# Altium project flying_pcb_v1.2.PrjPcb (part 1 of 2)
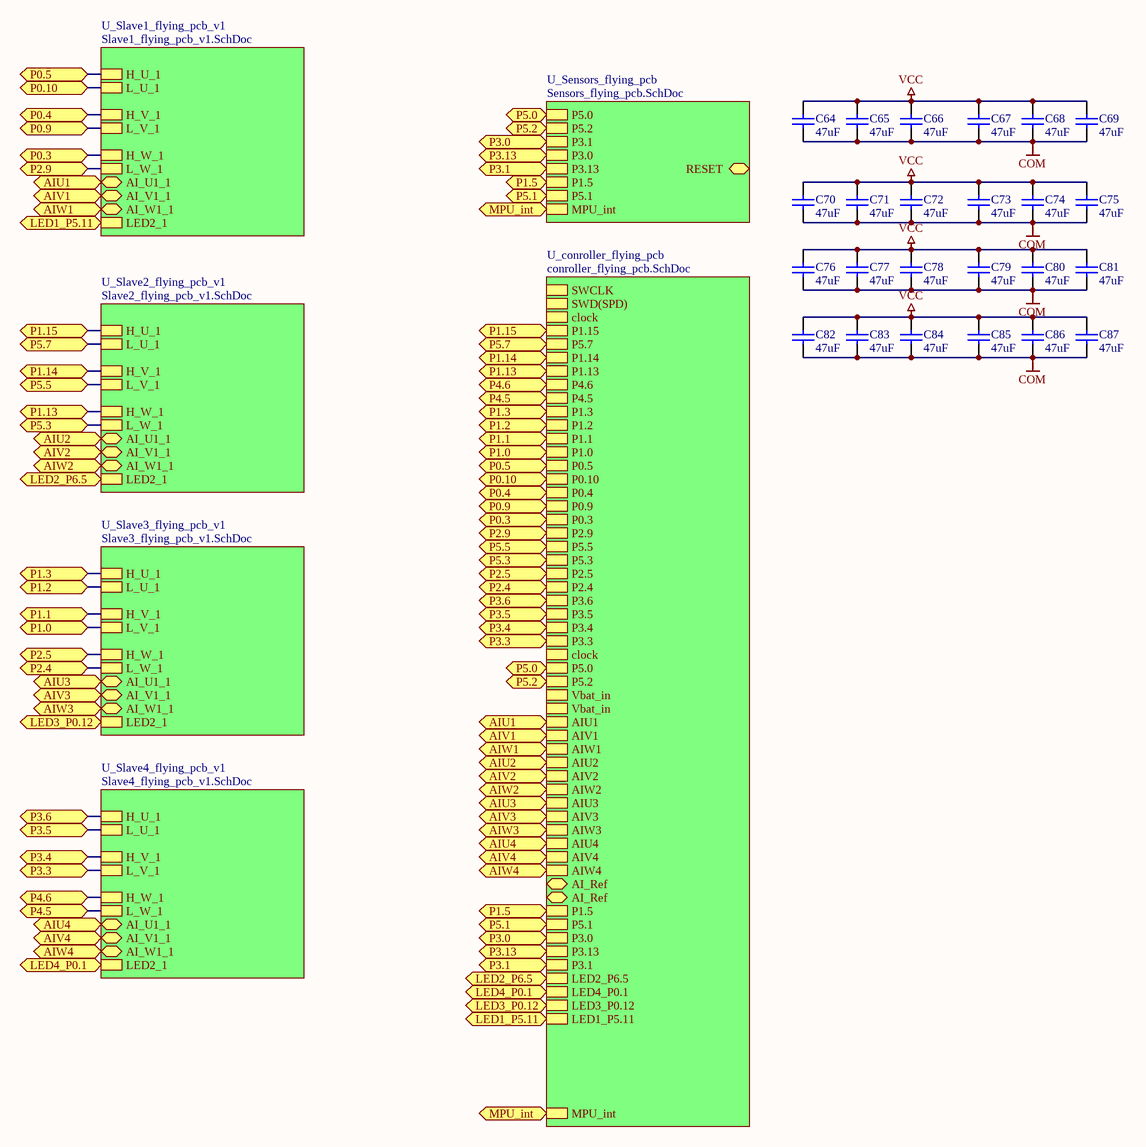
[diagram p0: Master_flying_pcb_v1.SchDoc]
7 sheets, 231 parts. Net scope: hierarchical (ports join the sheet entries above them; power ports are global).
Board file: flying_pcb_v1_production.PcbDoc
Sheets:
  Master_flying_pcb_v1.SchDoc
    U_Slave1_flying_pcb_v1 = Slave1_flying_pcb_v1.SchDoc
    U_Slave2_flying_pcb_v1 = Slave2_flying_pcb_v1.SchDoc
    U_Slave3_flying_pcb_v1 = Slave3_flying_pcb_v1.SchDoc
    U_Slave4_flying_pcb_v1 = Slave4_flying_pcb_v1.SchDoc
    U_Sensors_flying_pcb = Sensors_flying_pcb.SchDoc
    U_conroller_flying_pcb = conroller_flying_pcb.SchDoc

## Sheet Master_flying_pcb_v1.SchDoc
size A3

### Parts
C64  47uF  [_0805]
C65  47uF  [_0805]
C66  47uF  [_0805]
C67  47uF  [_0805]
C68  47uF  [_0805]
C69  47uF  [_0805]
C70  47uF  [_0805]
C71  47uF  [_0805]
C72  47uF  [_0805]
C73  47uF  [_0805]
C74  47uF  [_0805]
C75  47uF  [_0805]
C76  47uF  [_0805]
C77  47uF  [_0805]
C78  47uF  [_0805]
C79  47uF  [_0805]
C80  47uF  [_0805]
C81  47uF  [_0805]
C82  47uF  [_0805]
C83  47uF  [_0805]
C84  47uF  [_0805]
C85  47uF  [_0805]
C86  47uF  [_0805]
C87  47uF  [_0805]

### Sub-sheets
U_conroller_flying_pcb = conroller_flying_pcb.SchDoc: SWCLK, SWD(SPD), clock, P1.15, P5.7, P1.14, P1.13, P4.6, P4.5, P1.3, P1.2, P1.1, P1.0, P0.5, P0.10, P0.4, P0.9, P0.3, P2.9, P5.5, P5.3, P2.5, P2.4, P3.6, P3.5, P3.4, P3.3, clock, P5.0, P5.2, Vbat_in, Vbat_in, AIU1, AIV1, AIW1, AIU2, AIV2, AIW2, AIU3, AIV3, AIW3, AIU4, AIV4, AIW4, AI_Ref (bidir), AI_Ref (bidir), P1.5, P5.1, P3.0, P3.13, P3.1, LED2_P6.5, LED4_P0.1, LED3_P0.12, LED1_P5.11, MPU_int
U_Sensors_flying_pcb = Sensors_flying_pcb.SchDoc: P5.0, P5.2, P3.1, P3.0, P3.13, P1.5, P5.1, MPU_int, RESET
U_Slave1_flying_pcb_v1 = Slave1_flying_pcb_v1.SchDoc: H_U_1, L_U_1, H_V_1, L_V_1, H_W_1, L_W_1, AI_U1_1 (bidir), AI_V1_1 (bidir), AI_W1_1 (bidir), LED2_1
U_Slave2_flying_pcb_v1 = Slave2_flying_pcb_v1.SchDoc: H_U_1, L_U_1, H_V_1, L_V_1, H_W_1, L_W_1, AI_U1_1 (bidir), AI_V1_1 (bidir), AI_W1_1 (bidir), LED2_1
U_Slave3_flying_pcb_v1 = Slave3_flying_pcb_v1.SchDoc: H_U_1, L_U_1, H_V_1, L_V_1, H_W_1, L_W_1, AI_U1_1 (bidir), AI_V1_1 (bidir), AI_W1_1 (bidir), LED2_1
U_Slave4_flying_pcb_v1 = Slave4_flying_pcb_v1.SchDoc: H_U_1, L_U_1, H_V_1, L_V_1, H_W_1, L_W_1, AI_U1_1 (bidir), AI_V1_1 (bidir), AI_W1_1 (bidir), LED2_1

### Ports
AIU1, AIU2, AIU3, AIU4, AIV1, AIV2, AIV3, AIV4, AIW1, AIW2, AIW3, AIW4, LED1_P5.11, LED2_P6.5, LED3_P0.12, LED4_P0.1, MPU_int, P0.3, P0.4, P0.5, P0.9, P0.10, P1.0, P1.1, P1.2, P1.3, P1.5, P1.13, P1.14, P1.15, P2.4, P2.5, P2.9, P3.0, P3.1, P3.3, P3.4, P3.5, P3.6, P3.13, P4.5, P4.6, P5.0, P5.1, P5.2, P5.3, P5.5, P5.7

### Nets
COM: C64.1 C65.1 C66.1 C67.1 C68.1 C69.1 C70.1 C71.1 C72.1 C73.1 C74.1 C75.1 C76.1 C77.1 C78.1 C79.1 C80.1 C81.1 C82.1 C83.1 C84.1 C85.1 C86.1 C87.1
VCC: C64.2 C65.2 C66.2 C67.2 C68.2 C69.2 C70.2 C71.2 C72.2 C73.2 C74.2 C75.2 C76.2 C77.2 C78.2 C79.2 C80.2 C81.2 C82.2 C83.2 C84.2 C85.2 C86.2 C87.2
NetC38_2: sheet U_conroller_flying_pcb/Vbat_in, sheet U_conroller_flying_pcb/Vbat_in
NetDPS310_P3: port P3.1, sheet U_Sensors_flying_pcb/P3.13, sheet U_conroller_flying_pcb/P3.1
NetDPS310_P4: port P3.13, sheet U_Sensors_flying_pcb/P3.0, sheet U_conroller_flying_pcb/P3.13
NetDPS310_P5: port P3.0, sheet U_Sensors_flying_pcb/P3.1, sheet U_conroller_flying_pcb/P3.0
NetPAN1026_E6: port P5.1, sheet U_Sensors_flying_pcb/P5.1, sheet U_conroller_flying_pcb/P5.1
NetPAN1026_F7: port P1.5, sheet U_Sensors_flying_pcb/P1.5, sheet U_conroller_flying_pcb/P1.5
NetQ13_3: sheet U_conroller_flying_pcb/clock, sheet U_conroller_flying_pcb/clock
NetQ14_12: port MPU_int, sheet U_Sensors_flying_pcb/MPU_int, sheet U_conroller_flying_pcb/MPU_int
NetQ14_23: port P5.2, sheet U_Sensors_flying_pcb/P5.2, sheet U_conroller_flying_pcb/P5.2
NetQ14_24: port P5.0, sheet U_Sensors_flying_pcb/P5.0, sheet U_conroller_flying_pcb/P5.0
NetR3_2: port AIU1, sheet U_Slave1_flying_pcb_v1/AI_U1_1, sheet U_conroller_flying_pcb/AIU1
NetR9_2: port AIV1, sheet U_Slave1_flying_pcb_v1/AI_V1_1, sheet U_conroller_flying_pcb/AIV1
NetR15_2: port AIW1, sheet U_Slave1_flying_pcb_v1/AI_W1_1, sheet U_conroller_flying_pcb/AIW1
NetR19_1: port LED1_P5.11, sheet U_Slave1_flying_pcb_v1/LED2_1, sheet U_conroller_flying_pcb/LED1_P5.11
NetR22_2: port AIU2, sheet U_Slave2_flying_pcb_v1/AI_U1_1, sheet U_conroller_flying_pcb/AIU2
NetR28_2: port AIV2, sheet U_Slave2_flying_pcb_v1/AI_V1_1, sheet U_conroller_flying_pcb/AIV2
NetR34_2: port AIW2, sheet U_Slave2_flying_pcb_v1/AI_W1_1, sheet U_conroller_flying_pcb/AIW2
NetR38_1: port LED2_P6.5, sheet U_Slave2_flying_pcb_v1/LED2_1, sheet U_conroller_flying_pcb/LED2_P6.5
NetR41_2: port AIU3, sheet U_Slave3_flying_pcb_v1/AI_U1_1, sheet U_conroller_flying_pcb/AIU3
NetR47_2: port AIV3, sheet U_Slave3_flying_pcb_v1/AI_V1_1, sheet U_conroller_flying_pcb/AIV3
NetR53_2: port AIW3, sheet U_Slave3_flying_pcb_v1/AI_W1_1, sheet U_conroller_flying_pcb/AIW3
NetR57_1: port LED3_P0.12, sheet U_Slave3_flying_pcb_v1/LED2_1, sheet U_conroller_flying_pcb/LED3_P0.12
NetR60_2: port AIU4, sheet U_Slave4_flying_pcb_v1/AI_U1_1, sheet U_conroller_flying_pcb/AIU4
NetR66_2: port AIV4, sheet U_Slave4_flying_pcb_v1/AI_V1_1, sheet U_conroller_flying_pcb/AIV4
NetR72_2: port AIW4, sheet U_Slave4_flying_pcb_v1/AI_W1_1, sheet U_conroller_flying_pcb/AIW4
NetR76_1: port LED4_P0.1, sheet U_Slave4_flying_pcb_v1/LED2_1, sheet U_conroller_flying_pcb/LED4_P0.1
NetR86_2: sheet U_conroller_flying_pcb/AI_Ref, sheet U_conroller_flying_pcb/AI_Ref
NetU1_2: port P0.5, sheet U_Slave1_flying_pcb_v1/H_U_1, sheet U_conroller_flying_pcb/P0.5
NetU1_3: port P0.10, sheet U_Slave1_flying_pcb_v1/L_U_1, sheet U_conroller_flying_pcb/P0.10
NetU2_2: port P0.4, sheet U_Slave1_flying_pcb_v1/H_V_1, sheet U_conroller_flying_pcb/P0.4
NetU2_3: port P0.9, sheet U_Slave1_flying_pcb_v1/L_V_1, sheet U_conroller_flying_pcb/P0.9
NetU3_2: port P0.3, sheet U_Slave1_flying_pcb_v1/H_W_1, sheet U_conroller_flying_pcb/P0.3
NetU3_3: port P2.9, sheet U_Slave1_flying_pcb_v1/L_W_1, sheet U_conroller_flying_pcb/P2.9
NetU4_2: port P1.15, sheet U_Slave2_flying_pcb_v1/H_U_1, sheet U_conroller_flying_pcb/P1.15
NetU4_3: port P5.7, sheet U_Slave2_flying_pcb_v1/L_U_1, sheet U_conroller_flying_pcb/P5.7
NetU5_2: port P1.14, sheet U_Slave2_flying_pcb_v1/H_V_1, sheet U_conroller_flying_pcb/P1.14
NetU5_3: port P5.5, sheet U_Slave2_flying_pcb_v1/L_V_1, sheet U_conroller_flying_pcb/P5.5
NetU6_2: port P1.13, sheet U_Slave2_flying_pcb_v1/H_W_1, sheet U_conroller_flying_pcb/P1.13
NetU6_3: port P5.3, sheet U_Slave2_flying_pcb_v1/L_W_1, sheet U_conroller_flying_pcb/P5.3
NetU7_2: port P1.3, sheet U_Slave3_flying_pcb_v1/H_U_1, sheet U_conroller_flying_pcb/P1.3
NetU7_3: port P1.2, sheet U_Slave3_flying_pcb_v1/L_U_1, sheet U_conroller_flying_pcb/P1.2
NetU8_2: port P1.1, sheet U_Slave3_flying_pcb_v1/H_V_1, sheet U_conroller_flying_pcb/P1.1
NetU8_3: port P1.0, sheet U_Slave3_flying_pcb_v1/L_V_1, sheet U_conroller_flying_pcb/P1.0
NetU9_2: port P2.5, sheet U_Slave3_flying_pcb_v1/H_W_1, sheet U_conroller_flying_pcb/P2.5
NetU9_3: port P2.4, sheet U_Slave3_flying_pcb_v1/L_W_1, sheet U_conroller_flying_pcb/P2.4
NetU10_2: port P3.6, sheet U_Slave4_flying_pcb_v1/H_U_1, sheet U_conroller_flying_pcb/P3.6
NetU10_3: port P3.5, sheet U_Slave4_flying_pcb_v1/L_U_1, sheet U_conroller_flying_pcb/P3.5
NetU11_2: port P3.4, sheet U_Slave4_flying_pcb_v1/H_V_1, sheet U_conroller_flying_pcb/P3.4
NetU11_3: port P3.3, sheet U_Slave4_flying_pcb_v1/L_V_1, sheet U_conroller_flying_pcb/P3.3
NetU12_2: port P4.6, sheet U_Slave4_flying_pcb_v1/H_W_1, sheet U_conroller_flying_pcb/P4.6
NetU12_3: port P4.5, sheet U_Slave4_flying_pcb_v1/L_W_1, sheet U_conroller_flying_pcb/P4.5

### Library data of the parts
C64-C87 = Cap_128: Name: Cap_0805; QR: 0; UID: Cap_128; ComponentLink1URL: #NAME?; mounting: SMD

## Sheet Slave1_flying_pcb_v1.SchDoc
size A4
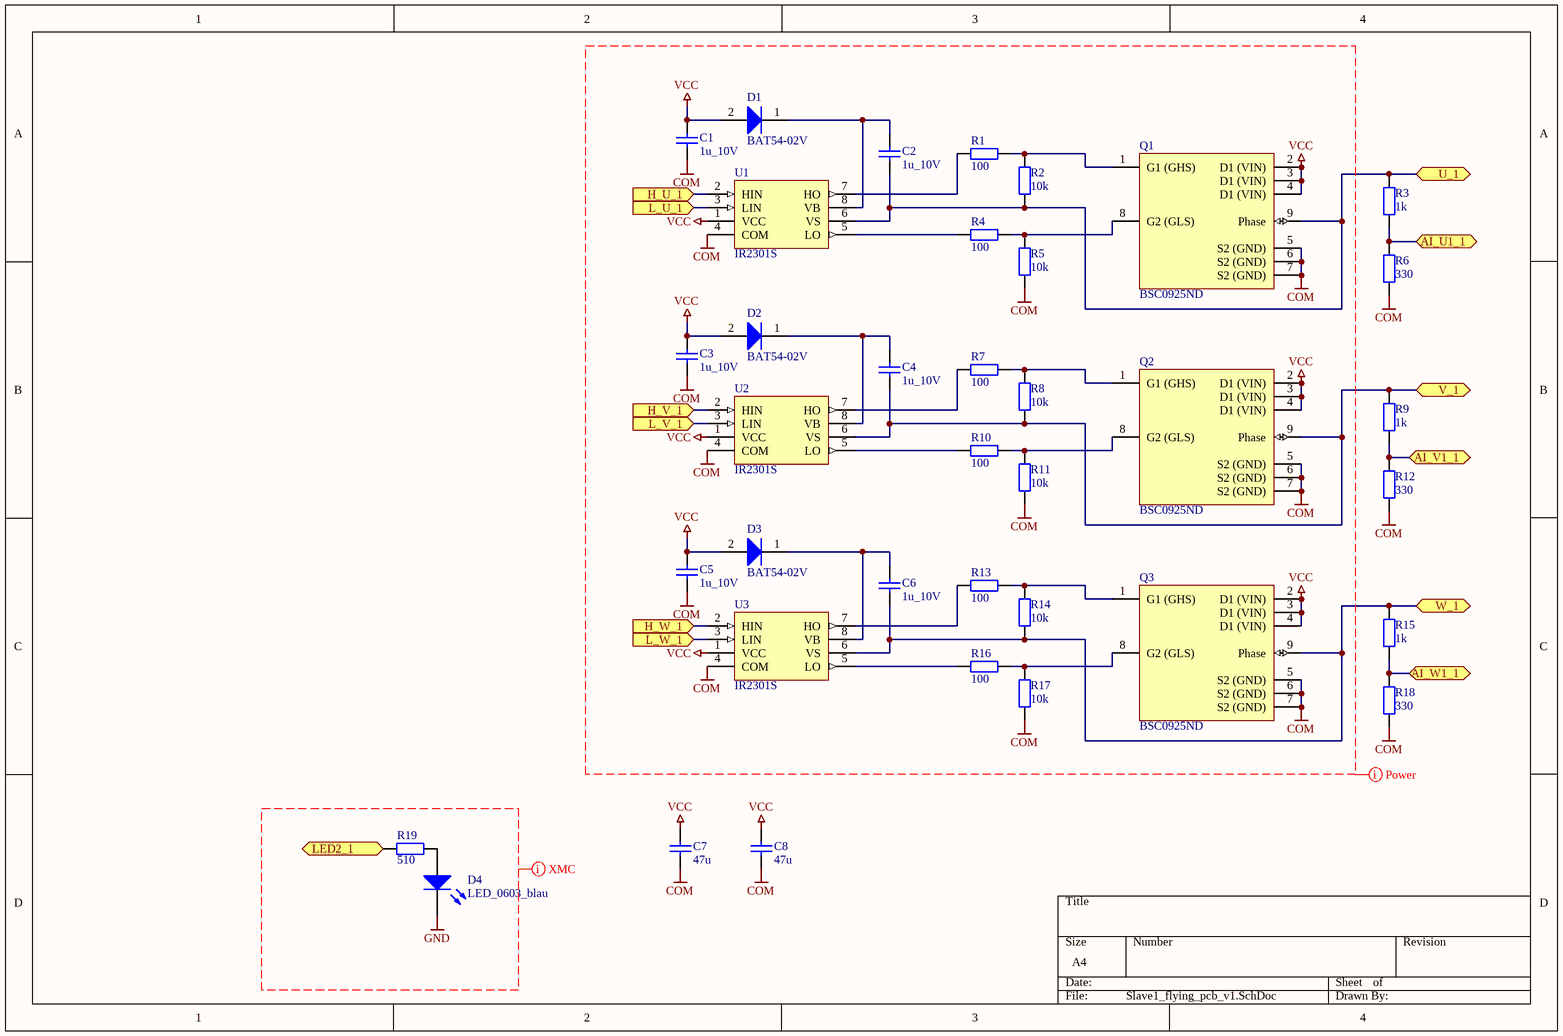
[diagram p1: Slave1_flying_pcb_v1.SchDoc]

### Parts
C1  1u_10V  [1608[0603]]
C2  1u_10V  [1608[0603]]
C3  1u_10V  [1608[0603]]
C4  1u_10V  [1608[0603]]
C5  1u_10V  [1608[0603]]
C6  1u_10V  [1608[0603]]
C7  47u  [_0805]
C8  47u  [_0805]
D1  BAT54-02V  [INF-SC79_V]
D2  BAT54-02V  [INF-SC79_V]
D3  BAT54-02V  [INF-SC79_V]
D4  LED_0603_blau  [LED_0603]
Q1  BSC0925ND  [INF-PG-TISON-8_V]
Q2  BSC0925ND  [INF-PG-TISON-8_V]
Q3  BSC0925ND  [INF-PG-TISON-8_V]
R1  value 100  [1608[0603]]  (hidden comment: Res_0603)
R2  value 10k  [1608[0603]]  (hidden comment: Res_0603)
R3  value 1k  [1608[0603]]  (hidden comment: Res_0603)
R4  value 100  [1608[0603]]  (hidden comment: Res_0603)
R5  value 10k  [1608[0603]]  (hidden comment: Res_0603)
R6  value 330  [1608[0603]]  (hidden comment: Res_0603)
R7  value 100  [1608[0603]]  (hidden comment: Res_0603)
R8  value 10k  [1608[0603]]  (hidden comment: Res_0603)
R9  value 1k  [1608[0603]]  (hidden comment: Res_0603)
R10  value 100  [1608[0603]]  (hidden comment: Res_0603)
R11  value 10k  [1608[0603]]  (hidden comment: Res_0603)
R12  value 330  [1608[0603]]  (hidden comment: Res_0603)
R13  value 100  [1608[0603]]  (hidden comment: Res_0603)
R14  value 10k  [1608[0603]]  (hidden comment: Res_0603)
R15  value 1k  [1608[0603]]  (hidden comment: Res_0603)
R16  value 100  [1608[0603]]  (hidden comment: Res_0603)
R17  value 10k  [1608[0603]]  (hidden comment: Res_0603)
R18  value 330  [1608[0603]]  (hidden comment: Res_0603)
R19  value 510  [1608[0603]]  (hidden comment: Res_0603)
U1  IR2301S  [SO-8_N]
U2  IR2301S  [SO-8_N]
U3  IR2301S  [SO-8_N]

### Ports
AI_U1_1 (bidir), AI_V1_1 (bidir), AI_W1_1 (bidir), H_U_1, H_V_1, H_W_1, L_U_1, L_V_1, L_W_1, LED2_1, U_1 (bidir), V_1 (bidir), W_1 (bidir)

### Nets
COM: C1.2 C3.2 C5.2 C7.1 C8.1 Q1.5(S2_(GND)) Q1.6(S2_(GND)) Q1.7(S2_(GND)) Q2.5(S2_(GND)) Q2.6(S2_(GND)) Q2.7(S2_(GND)) Q3.5(S2_(GND)) Q3.6(S2_(GND)) Q3.7(S2_(GND)) R5.2 R6.2 R11.2 R12.2 R17.2 R18.2 U1.4(COM) U2.4(COM) U3.4(COM)
GND: D4.2
VCC: C1.1 C3.1 C5.1 C7.2 C8.2 D1.2(A) D2.2(A) D3.2(A) Q1.2(D1_(VIN)) Q1.3(D1_(VIN)) Q1.4(D1_(VIN)) Q2.2(D1_(VIN)) Q2.3(D1_(VIN)) Q2.4(D1_(VIN)) Q3.2(D1_(VIN)) Q3.3(D1_(VIN)) Q3.4(D1_(VIN)) U1.1(VCC) U2.1(VCC) U3.1(VCC)
NetC2_1: C2.1 D1.1(K) U1.8(VB)
NetC2_2: C2.2 Q1.9(Phase) R2.2 R3.1 U1.6(VS) ; port U_1
NetC4_1: C4.1 D2.1(K) U2.8(VB)
NetC4_2: C4.2 Q2.9(Phase) R8.2 R9.1 U2.6(VS) ; port V_1
NetC6_1: C6.1 D3.1(K) U3.8(VB)
NetC6_2: C6.2 Q3.9(Phase) R14.2 R15.1 U3.6(VS) ; port W_1
NetD4_1: D4.1 R19.2
NetQ1_1: Q1.1(G1_(GHS)) R1.1 R2.1
NetQ1_8: Q1.8(G2_(GLS)) R4.1 R5.1
NetQ2_1: Q2.1(G1_(GHS)) R7.1 R8.1
NetQ2_8: Q2.8(G2_(GLS)) R10.1 R11.1
NetQ3_1: Q3.1(G1_(GHS)) R13.1 R14.1
NetQ3_8: Q3.8(G2_(GLS)) R16.1 R17.1
NetR1_2: R1.2 U1.7(HO)
NetR3_2: R3.2 R6.1 ; port AI_U1_1
NetR4_2: R4.2 U1.5(LO)
NetR7_2: R7.2 U2.7(HO)
NetR9_2: R9.2 R12.1 ; port AI_V1_1
NetR10_2: R10.2 U2.5(LO)
NetR13_2: R13.2 U3.7(HO)
NetR15_2: R15.2 R18.1 ; port AI_W1_1
NetR16_2: R16.2 U3.5(LO)
NetR19_1: R19.1 ; port LED2_1
NetU1_2: U1.2(HIN) ; port H_U_1
NetU1_3: U1.3(LIN) ; port L_U_1
NetU2_2: U2.2(HIN) ; port H_V_1
NetU2_3: U2.3(LIN) ; port L_V_1
NetU3_2: U3.2(HIN) ; port H_W_1
NetU3_3: U3.3(LIN) ; port L_W_1

### Layout directives
net class Power: COM, VCC
net class XMC: GND

### Library data of the parts
C1-C6 = Cap_133: RS_number: 788-2884; QR: 0; Capacity: 1u; Voltage: 10V; UID: Cap_133; Name: 1u_10V; Name_Hyperlink: http://at.rs-online.com/web/p/keramik-multilayer-kondensatoren/7882884; ComponentLink1URL: #NAME?; mounting: SMD
C7 C8 = Cap_133: Name: Cap_cer_1u_50V; Capacity: 1u; Voltage: 50V; RS_number: 723-6350; QR: 0; UID: Cap_133; ComponentLink1URL: #NAME?; mounting: SMD; Name_Hyperlink: http://at.rs-online.com/web/p/keramik-multilayer-kondensatoren/7236350/
D1-D3 = BAT54-02V: Silicon Schottky Diode, SC79, Reel, Green; Manufacturer: Infineon; Green: TRUE; PackageReference: SC79; PackageDescription: 2-Pin Semiconductor Package, 0.8 x 1.2 mm Body; Supplier 1: Mouser; Supplier Part Number 1: N/A; Halogen-free: FALSE; Mounting Technology: Surface Mount; PartNumber: BAT54-02V; ComponentLink1Description: Manufacturer URL; ComponentLink1URL: http://www.infineon.com/; ComponentLink2Description: Datasheet; ComponentLink2URL: http://www.infineon.com/dgdl/bat54series.pdf?folderId=db3a30431400ef68011425f1ca2505e3&fileId=db3a304314dca3890115190b74210ea6; ComponentLink3Description: Package Specification; ComponentLink3URL: http://www.infineon.com/dgdl/SC79-Package_Overview.pdf?folderId=db3a30431936bc4b011951fbddb03b15&fileId=db3a30431936bc4b01195226fe583b41
D4 = DIODE_60: Type: LED; Colour: blau; RS_number: 697-3610P; QR: 0; UID: DIODE_60; Name: LED_0603_blau; Name_Hyperlink: http://at.rs-online.com/web/p/products/6973610P/; ComponentLink1URL: #WERT!; mounting: SMD
Q1-Q3 = BSC0925ND: N-Channel OptiMOS Power-MOSFET, 30 V VDS, 40 A ID, -55 to 150 degC, PG-TISON-8, Reel, Green; Manufacturer: Infineon; Green: TRUE; ID (max): 40 A; IDpuls (max): 160 A; Polarity: N; Ptot (max): 30 W; QG: 6.7 nC; RDS (on) (max): 5 mOhm; RDS (on) (max) (@4.5V): 7 mOhm; Rth: 4.2 K/W; RthJA (max): 125 K/W; VDS (max): 30 V; VGS(th) (max): 2 V; VGS(th) (min): 1.2 V; DatasheetVersion: Rev. 1.0; PackageVersion: Rev. 01, 09/2011; PackageReference: PG-TISON-8; PackageDescription: 8-Pin Plastic (Green) Small Outline Non-Leaded Package, 5 x 6 mm Body, 1.27 mm Pitch; Halogen-free: TRUE; Packing: Reel; RthJC (max): 4.2 K/W; Mounting Technology: Surface Mount; PartNumber: BSC0925ND; ComponentLink1Description: Manufacturer URL; ComponentLink1URL: http://www.infineon.com/; ComponentLink2Description: Datasheet; ComponentLink2URL: http://www.infineon.com/dgdl/BSC0925ND_rev1+0.pdf?folderId=db3a304313b8b5a60113cee8763b02d7&fileId=db3a304336ca04c90136cec562a24914; ComponentLink3Description: Package Specification; ComponentLink3URL: http://www.infineon.com/dgdl/BSC0910NDI_Rev. 0.5.pdf?folderId=db3a304313b8b5a60113cee8763b02d7&fileId=db3a304336ca04c90136cedc08b64926
R1-R19 = Res_6: UID: Res_6; Name: Res_0603; ComponentLink1URL: #NAME?; mounting: SMD
U1-U3 = IR2101S: High and Low Side Driver; Published: 8-Jun-2000; LatestRevisionDate: 13-Apr-2006; LatestRevisionNote: IPC-7351 Footprint Added.; DatasheetVersion: PD60043J; PackageVersion: Feb-2001; PackageReference: SO-8; Publisher: Altium Limited; PackageDescription: 8-Pin Plastic Small Outline Integrated Circuit 1.27 mm Pitch; Code_JEDEC: MS-012-AA; Code_IPC: SOIC127P600-8; ComponentLink1Description: Manufacturer Link; ComponentLink1URL: http://www.irf.com/

## Sheet Slave2_flying_pcb_v1.SchDoc
size A4
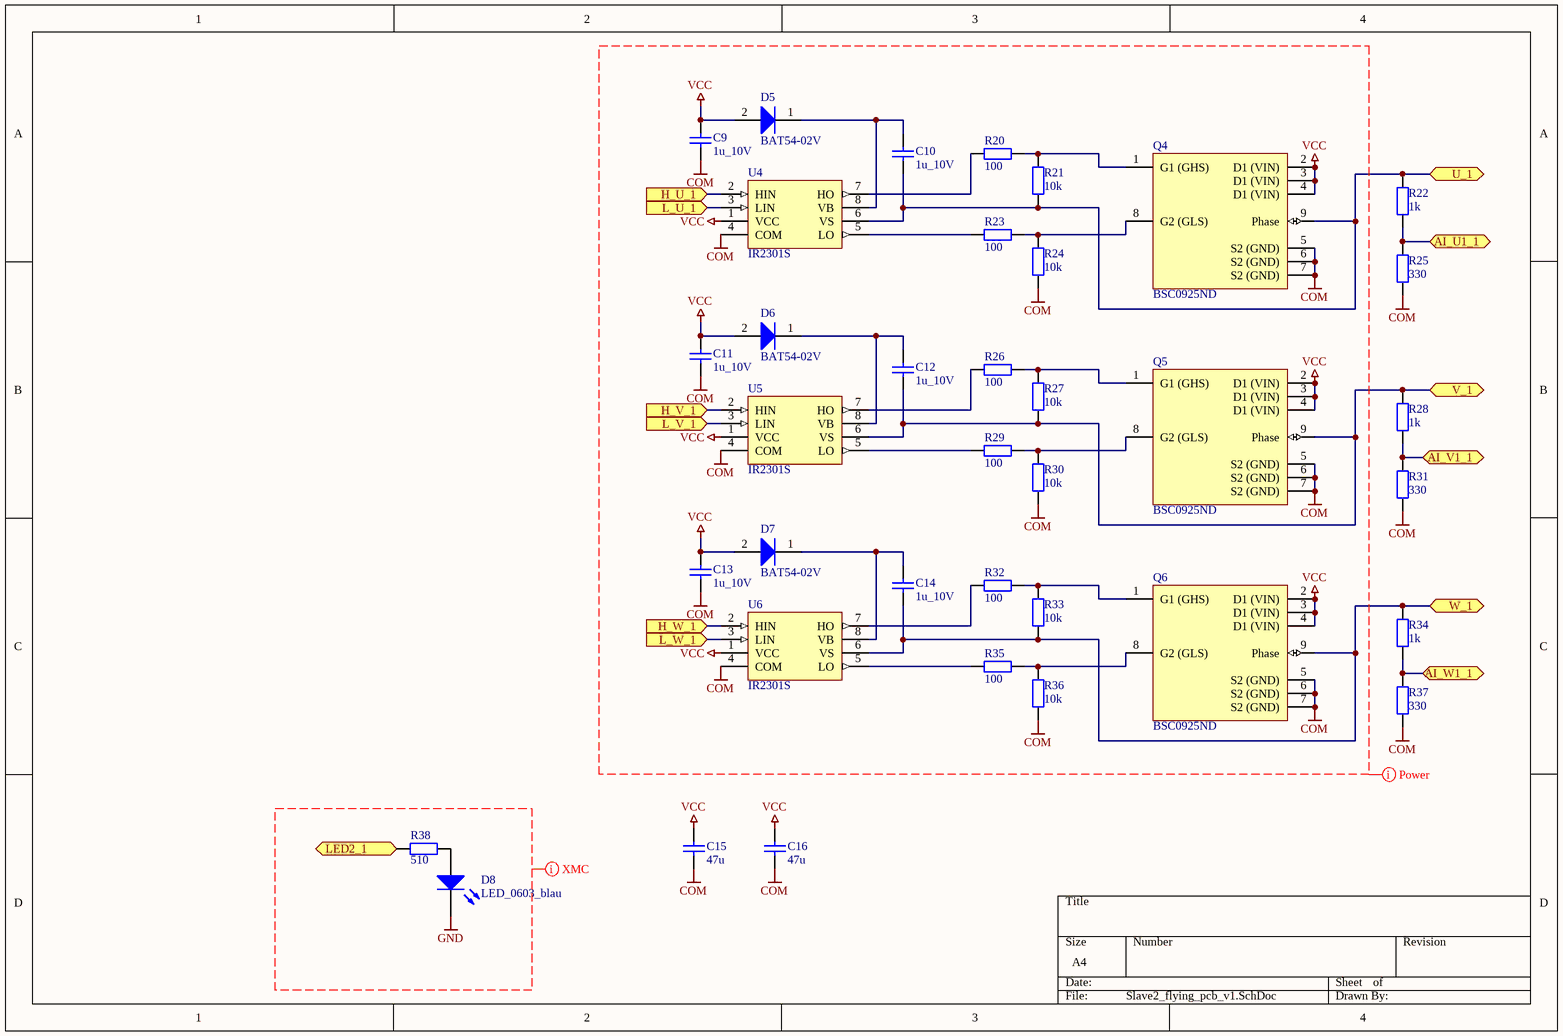
[diagram p2: Slave2_flying_pcb_v1.SchDoc]

### Parts
(Parts that share a designator on the sheet are numbered #1, #2 ... from top to bottom, then left to right.)
C9  1u_10V  [1608[0603]]
C10  1u_10V  [1608[0603]]
C11  1u_10V  [1608[0603]]
C12  1u_10V  [1608[0603]]
C13  1u_10V  [1608[0603]]
C14  1u_10V  [1608[0603]]
C15  47u  [_0805]
C16  47u  [_0805]
D5  BAT54-02V  [INF-SC79_V]
D6#1  BAT54-02V  [INF-SC79_V]
D7  BAT54-02V  [INF-SC79_V]
D8  LED_0603_blau  [LED_0603]
Q4  BSC0925ND  [INF-PG-TISON-8_V]
Q5  BSC0925ND  [INF-PG-TISON-8_V]
Q6  BSC0925ND  [INF-PG-TISON-8_V]
R20  value 100  [1608[0603]]  (hidden comment: Res_0603)
R21  value 10k  [1608[0603]]  (hidden comment: Res_0603)
R22  value 1k  [1608[0603]]  (hidden comment: Res_0603)
R23  value 100  [1608[0603]]  (hidden comment: Res_0603)
R24  value 10k  [1608[0603]]  (hidden comment: Res_0603)
R25  value 330  [1608[0603]]  (hidden comment: Res_0603)
R26  value 100  [1608[0603]]  (hidden comment: Res_0603)
R27  value 10k  [1608[0603]]  (hidden comment: Res_0603)
R28  value 1k  [1608[0603]]  (hidden comment: Res_0603)
R29  value 100  [1608[0603]]  (hidden comment: Res_0603)
R30  value 10k  [1608[0603]]  (hidden comment: Res_0603)
R31  value 330  [1608[0603]]  (hidden comment: Res_0603)
R32  value 100  [1608[0603]]  (hidden comment: Res_0603)
R33  value 10k  [1608[0603]]  (hidden comment: Res_0603)
R34  value 1k  [1608[0603]]  (hidden comment: Res_0603)
R35  value 100  [1608[0603]]  (hidden comment: Res_0603)
R36  value 10k  [1608[0603]]  (hidden comment: Res_0603)
R37  value 330  [1608[0603]]  (hidden comment: Res_0603)
R38  value 510  [1608[0603]]  (hidden comment: Res_0603)
U4  IR2301S  [SO-8_N]
U5  IR2301S  [SO-8_N]
U6  IR2301S  [SO-8_N]

### Ports
AI_U1_1 (bidir), AI_V1_1 (bidir), AI_W1_1 (bidir), H_U_1, H_V_1, H_W_1, L_U_1, L_V_1, L_W_1, LED2_1, U_1 (bidir), V_1 (bidir), W_1 (bidir)

### Nets
COM: C9.2 C11.2 C13.2 C15.1 C16.1 Q4.5(S2_(GND)) Q4.6(S2_(GND)) Q4.7(S2_(GND)) Q5.5(S2_(GND)) Q5.6(S2_(GND)) Q5.7(S2_(GND)) Q6.5(S2_(GND)) Q6.6(S2_(GND)) Q6.7(S2_(GND)) R24.2 R25.2 R30.2 R31.2 R36.2 R37.2 U4.4(COM) U5.4(COM) U6.4(COM)
GND: D8.2
VCC: C9.1 C11.1 C13.1 C15.2 C16.2 D5.2(A) D6#1.2(A) D7.2(A) Q4.2(D1_(VIN)) Q4.3(D1_(VIN)) Q4.4(D1_(VIN)) Q5.2(D1_(VIN)) Q5.3(D1_(VIN)) Q5.4(D1_(VIN)) Q6.2(D1_(VIN)) Q6.3(D1_(VIN)) Q6.4(D1_(VIN)) U4.1(VCC) U5.1(VCC) U6.1(VCC)
NetC10_1: C10.1 D5.1(K) U4.8(VB)
NetC10_2: C10.2 Q4.9(Phase) R21.2 R22.1 U4.6(VS) ; port U_1
NetC12_1: C12.1 D6#1.1(K) U5.8(VB)
NetC12_2: C12.2 Q5.9(Phase) R27.2 R28.1 U5.6(VS) ; port V_1
NetC14_1: C14.1 D7.1(K) U6.8(VB)
NetC14_2: C14.2 Q6.9(Phase) R33.2 R34.1 U6.6(VS) ; port W_1
NetD8_1: D8.1 R38.2
NetQ4_1: Q4.1(G1_(GHS)) R20.1 R21.1
NetQ4_8: Q4.8(G2_(GLS)) R23.1 R24.1
NetQ5_1: Q5.1(G1_(GHS)) R26.1 R27.1
NetQ5_8: Q5.8(G2_(GLS)) R29.1 R30.1
NetQ6_1: Q6.1(G1_(GHS)) R32.1 R33.1
NetQ6_8: Q6.8(G2_(GLS)) R35.1 R36.1
NetR20_2: R20.2 U4.7(HO)
NetR22_2: R22.2 R25.1 ; port AI_U1_1
NetR23_2: R23.2 U4.5(LO)
NetR26_2: R26.2 U5.7(HO)
NetR28_2: R28.2 R31.1 ; port AI_V1_1
NetR29_2: R29.2 U5.5(LO)
NetR32_2: R32.2 U6.7(HO)
NetR34_2: R34.2 R37.1 ; port AI_W1_1
NetR35_2: R35.2 U6.5(LO)
NetR38_1: R38.1 ; port LED2_1
NetU4_2: U4.2(HIN) ; port H_U_1
NetU4_3: U4.3(LIN) ; port L_U_1
NetU5_2: U5.2(HIN) ; port H_V_1
NetU5_3: U5.3(LIN) ; port L_V_1
NetU6_2: U6.2(HIN) ; port H_W_1
NetU6_3: U6.3(LIN) ; port L_W_1

### Layout directives
net class Power: COM, VCC
net class XMC: GND

### Library data of the parts
C9-C14 = Cap_133: as C1 on sheet Slave1_flying_pcb_v1; UID: Cap_133; Name: 1u_10V; Name_Hyperlink: http://at.rs-online.com/web/p/keramik-multilayer-kondensatoren/7882884; ComponentLink1URL: #NAME?; mounting: SMD
C15 C16 = Cap_133: as C7 on sheet Slave1_flying_pcb_v1; UID: Cap_133; ComponentLink1URL: #NAME?; mounting: SMD; Name_Hyperlink: http://at.rs-online.com/web/p/keramik-multilayer-kondensatoren/7236350/
D5 D6#1 D7 = BAT54-02V: as D1 on sheet Slave1_flying_pcb_v1; PackageReference: SC79; PackageDescription: 2-Pin Semiconductor Package, 0.8 x 1.2 mm Body; Supplier 1: Mouser; Supplier Part Number 1: N/A; Halogen-free: FALSE; Mounting Technology: Surface Mount; PartNumber: BAT54-02V; ComponentLink1Description: Manufacturer URL; ComponentLink1URL: http://www.infineon.com/; ComponentLink2Description: Datasheet; ComponentLink2URL: http://www.infineon.com/dgdl/bat54series.pdf?folderId=db3a30431400ef68011425f1ca2505e3&fileId=db3a304314dca3890115190b74210ea6; ComponentLink3Description: Package Specification; ComponentLink3URL: http://www.infineon.com/dgdl/SC79-Package_Overview.pdf?folderId=db3a30431936bc4b011951fbddb03b15&fileId=db3a30431936bc4b01195226fe583b41
D8 = DIODE_60: as D4 on sheet Slave1_flying_pcb_v1; UID: DIODE_60; Name: LED_0603_blau; Name_Hyperlink: http://at.rs-online.com/web/p/products/6973610P/; ComponentLink1URL: #WERT!; mounting: SMD
Q4-Q6 = BSC0925ND: as Q1 on sheet Slave1_flying_pcb_v1; DatasheetVersion: Rev. 1.0; PackageVersion: Rev. 01, 09/2011; PackageReference: PG-TISON-8; PackageDescription: 8-Pin Plastic (Green) Small Outline Non-Leaded Package, 5 x 6 mm Body, 1.27 mm Pitch; Halogen-free: TRUE; Packing: Reel; RthJC (max): 4.2 K/W; Mounting Technology: Surface Mount; PartNumber: BSC0925ND; ComponentLink1Description: Manufacturer URL; ComponentLink1URL: http://www.infineon.com/; ComponentLink2Description: Datasheet; ComponentLink2URL: http://www.infineon.com/dgdl/BSC0925ND_rev1+0.pdf?folderId=db3a304313b8b5a60113cee8763b02d7&fileId=db3a304336ca04c90136cec562a24914; ComponentLink3Description: Package Specification; ComponentLink3URL: http://www.infineon.com/dgdl/BSC0910NDI_Rev. 0.5.pdf?folderId=db3a304313b8b5a60113cee8763b02d7&fileId=db3a304336ca04c90136cedc08b64926
R20-R38 = Res_6: UID: Res_6; Name: Res_0603; ComponentLink1URL: #NAME?; mounting: SMD
U4-U6 = IR2101S: High and Low Side Driver; Published: 8-Jun-2000; LatestRevisionDate: 13-Apr-2006; LatestRevisionNote: IPC-7351 Footprint Added.; DatasheetVersion: PD60043J; PackageVersion: Feb-2001; PackageReference: SO-8; Publisher: Altium Limited; PackageDescription: 8-Pin Plastic Small Outline Integrated Circuit 1.27 mm Pitch; Code_JEDEC: MS-012-AA; Code_IPC: SOIC127P600-8; ComponentLink1Description: Manufacturer Link; ComponentLink1URL: http://www.irf.com/

## Sheet Slave3_flying_pcb_v1.SchDoc
size A4
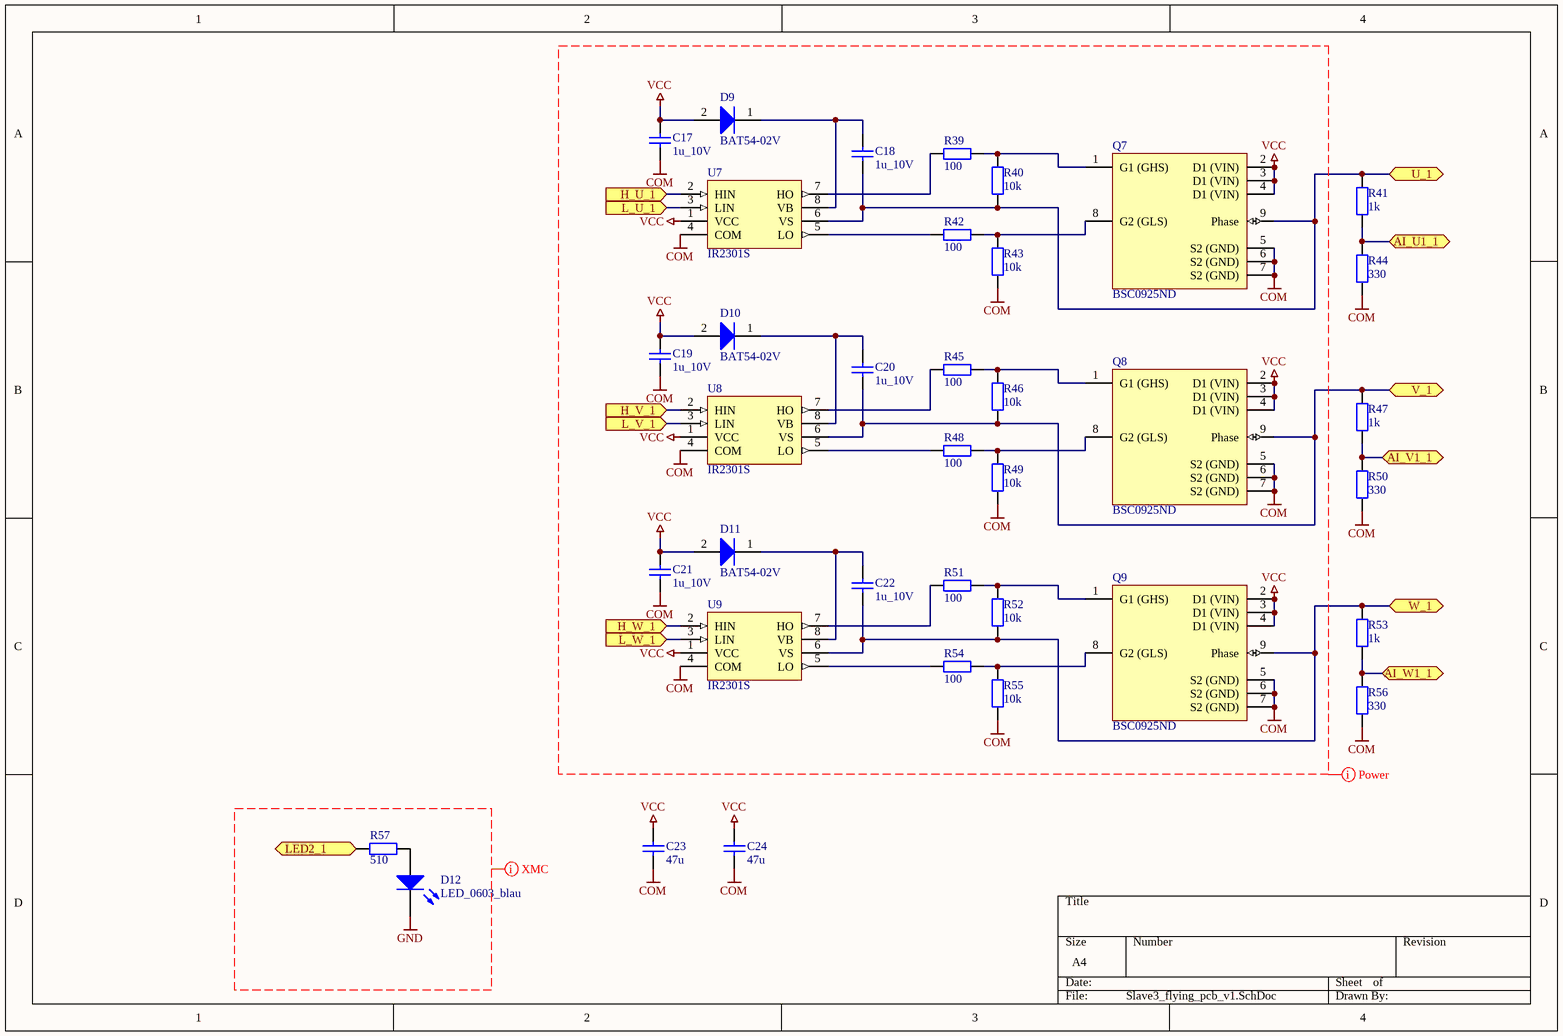
[diagram p3: Slave3_flying_pcb_v1.SchDoc]

### Parts
C17  1u_10V  [1608[0603]]
C18  1u_10V  [1608[0603]]
C19  1u_10V  [1608[0603]]
C20  1u_10V  [1608[0603]]
C21  1u_10V  [1608[0603]]
C22  1u_10V  [1608[0603]]
C23  47u  [_0805]
C24  47u  [_0805]
D9  BAT54-02V  [INF-SC79_V]
D10  BAT54-02V  [INF-SC79_V]
D11  BAT54-02V  [INF-SC79_V]
D12  LED_0603_blau  [LED_0603]
Q7  BSC0925ND  [INF-PG-TISON-8_V]
Q8  BSC0925ND  [INF-PG-TISON-8_V]
Q9  BSC0925ND  [INF-PG-TISON-8_V]
R39  value 100  [1608[0603]]  (hidden comment: Res_0603)
R40  value 10k  [1608[0603]]  (hidden comment: Res_0603)
R41  value 1k  [1608[0603]]  (hidden comment: Res_0603)
R42  value 100  [1608[0603]]  (hidden comment: Res_0603)
R43  value 10k  [1608[0603]]  (hidden comment: Res_0603)
R44  value 330  [1608[0603]]  (hidden comment: Res_0603)
R45  value 100  [1608[0603]]  (hidden comment: Res_0603)
R46  value 10k  [1608[0603]]  (hidden comment: Res_0603)
R47  value 1k  [1608[0603]]  (hidden comment: Res_0603)
R48  value 100  [1608[0603]]  (hidden comment: Res_0603)
R49  value 10k  [1608[0603]]  (hidden comment: Res_0603)
R50  value 330  [1608[0603]]  (hidden comment: Res_0603)
R51  value 100  [1608[0603]]  (hidden comment: Res_0603)
R52  value 10k  [1608[0603]]  (hidden comment: Res_0603)
R53  value 1k  [1608[0603]]  (hidden comment: Res_0603)
R54  value 100  [1608[0603]]  (hidden comment: Res_0603)
R55  value 10k  [1608[0603]]  (hidden comment: Res_0603)
R56  value 330  [1608[0603]]  (hidden comment: Res_0603)
R57  value 510  [1608[0603]]  (hidden comment: Res_0603)
U7  IR2301S  [SO-8_N]
U8  IR2301S  [SO-8_N]
U9  IR2301S  [SO-8_N]

### Ports
AI_U1_1 (bidir), AI_V1_1 (bidir), AI_W1_1 (bidir), H_U_1, H_V_1, H_W_1, L_U_1, L_V_1, L_W_1, LED2_1, U_1 (bidir), V_1 (bidir), W_1 (bidir)

### Nets
COM: C17.2 C19.2 C21.2 C23.1 C24.1 Q7.5(S2_(GND)) Q7.6(S2_(GND)) Q7.7(S2_(GND)) Q8.5(S2_(GND)) Q8.6(S2_(GND)) Q8.7(S2_(GND)) Q9.5(S2_(GND)) Q9.6(S2_(GND)) Q9.7(S2_(GND)) R43.2 R44.2 R49.2 R50.2 R55.2 R56.2 U7.4(COM) U8.4(COM) U9.4(COM)
GND: D12.2
VCC: C17.1 C19.1 C21.1 C23.2 C24.2 D9.2(A) D10.2(A) D11.2(A) Q7.2(D1_(VIN)) Q7.3(D1_(VIN)) Q7.4(D1_(VIN)) Q8.2(D1_(VIN)) Q8.3(D1_(VIN)) Q8.4(D1_(VIN)) Q9.2(D1_(VIN)) Q9.3(D1_(VIN)) Q9.4(D1_(VIN)) U7.1(VCC) U8.1(VCC) U9.1(VCC)
NetC18_1: C18.1 D9.1(K) U7.8(VB)
NetC18_2: C18.2 Q7.9(Phase) R40.2 R41.1 U7.6(VS) ; port U_1
NetC20_1: C20.1 D10.1(K) U8.8(VB)
NetC20_2: C20.2 Q8.9(Phase) R46.2 R47.1 U8.6(VS) ; port V_1
NetC22_1: C22.1 D11.1(K) U9.8(VB)
NetC22_2: C22.2 Q9.9(Phase) R52.2 R53.1 U9.6(VS) ; port W_1
NetD12_1: D12.1 R57.2
NetQ7_1: Q7.1(G1_(GHS)) R39.1 R40.1
NetQ7_8: Q7.8(G2_(GLS)) R42.1 R43.1
NetQ8_1: Q8.1(G1_(GHS)) R45.1 R46.1
NetQ8_8: Q8.8(G2_(GLS)) R48.1 R49.1
NetQ9_1: Q9.1(G1_(GHS)) R51.1 R52.1
NetQ9_8: Q9.8(G2_(GLS)) R54.1 R55.1
NetR39_2: R39.2 U7.7(HO)
NetR41_2: R41.2 R44.1 ; port AI_U1_1
NetR42_2: R42.2 U7.5(LO)
NetR45_2: R45.2 U8.7(HO)
NetR47_2: R47.2 R50.1 ; port AI_V1_1
NetR48_2: R48.2 U8.5(LO)
NetR51_2: R51.2 U9.7(HO)
NetR53_2: R53.2 R56.1 ; port AI_W1_1
NetR54_2: R54.2 U9.5(LO)
NetR57_1: R57.1 ; port LED2_1
NetU7_2: U7.2(HIN) ; port H_U_1
NetU7_3: U7.3(LIN) ; port L_U_1
NetU8_2: U8.2(HIN) ; port H_V_1
NetU8_3: U8.3(LIN) ; port L_V_1
NetU9_2: U9.2(HIN) ; port H_W_1
NetU9_3: U9.3(LIN) ; port L_W_1

### Layout directives
net class Power: COM, VCC
net class XMC: GND

### Library data of the parts
C17-C22 = Cap_133: as C1 on sheet Slave1_flying_pcb_v1; UID: Cap_133; Name: 1u_10V; Name_Hyperlink: http://at.rs-online.com/web/p/keramik-multilayer-kondensatoren/7882884; ComponentLink1URL: #NAME?; mounting: SMD
C23 C24 = Cap_133: as C7 on sheet Slave1_flying_pcb_v1; UID: Cap_133; ComponentLink1URL: #NAME?; mounting: SMD; Name_Hyperlink: http://at.rs-online.com/web/p/keramik-multilayer-kondensatoren/7236350/
D9-D11 = BAT54-02V: as D1 on sheet Slave1_flying_pcb_v1; PackageReference: SC79; PackageDescription: 2-Pin Semiconductor Package, 0.8 x 1.2 mm Body; Supplier 1: Mouser; Supplier Part Number 1: N/A; Halogen-free: FALSE; Mounting Technology: Surface Mount; PartNumber: BAT54-02V; ComponentLink1Description: Manufacturer URL; ComponentLink1URL: http://www.infineon.com/; ComponentLink2Description: Datasheet; ComponentLink2URL: http://www.infineon.com/dgdl/bat54series.pdf?folderId=db3a30431400ef68011425f1ca2505e3&fileId=db3a304314dca3890115190b74210ea6; ComponentLink3Description: Package Specification; ComponentLink3URL: http://www.infineon.com/dgdl/SC79-Package_Overview.pdf?folderId=db3a30431936bc4b011951fbddb03b15&fileId=db3a30431936bc4b01195226fe583b41
D12 = DIODE_60: as D4 on sheet Slave1_flying_pcb_v1; UID: DIODE_60; Name: LED_0603_blau; Name_Hyperlink: http://at.rs-online.com/web/p/products/6973610P/; ComponentLink1URL: #WERT!; mounting: SMD
Q7-Q9 = BSC0925ND: as Q1 on sheet Slave1_flying_pcb_v1; DatasheetVersion: Rev. 1.0; PackageVersion: Rev. 01, 09/2011; PackageReference: PG-TISON-8; PackageDescription: 8-Pin Plastic (Green) Small Outline Non-Leaded Package, 5 x 6 mm Body, 1.27 mm Pitch; Halogen-free: TRUE; Packing: Reel; RthJC (max): 4.2 K/W; Mounting Technology: Surface Mount; PartNumber: BSC0925ND; ComponentLink1Description: Manufacturer URL; ComponentLink1URL: http://www.infineon.com/; ComponentLink2Description: Datasheet; ComponentLink2URL: http://www.infineon.com/dgdl/BSC0925ND_rev1+0.pdf?folderId=db3a304313b8b5a60113cee8763b02d7&fileId=db3a304336ca04c90136cec562a24914; ComponentLink3Description: Package Specification; ComponentLink3URL: http://www.infineon.com/dgdl/BSC0910NDI_Rev. 0.5.pdf?folderId=db3a304313b8b5a60113cee8763b02d7&fileId=db3a304336ca04c90136cedc08b64926
R39-R57 = Res_6: UID: Res_6; Name: Res_0603; ComponentLink1URL: #NAME?; mounting: SMD
U7-U9 = IR2101S: High and Low Side Driver; Published: 8-Jun-2000; LatestRevisionDate: 13-Apr-2006; LatestRevisionNote: IPC-7351 Footprint Added.; DatasheetVersion: PD60043J; PackageVersion: Feb-2001; PackageReference: SO-8; Publisher: Altium Limited; PackageDescription: 8-Pin Plastic Small Outline Integrated Circuit 1.27 mm Pitch; Code_JEDEC: MS-012-AA; Code_IPC: SOIC127P600-8; ComponentLink1Description: Manufacturer Link; ComponentLink1URL: http://www.irf.com/

## Sheet Slave4_flying_pcb_v1.SchDoc
size A4
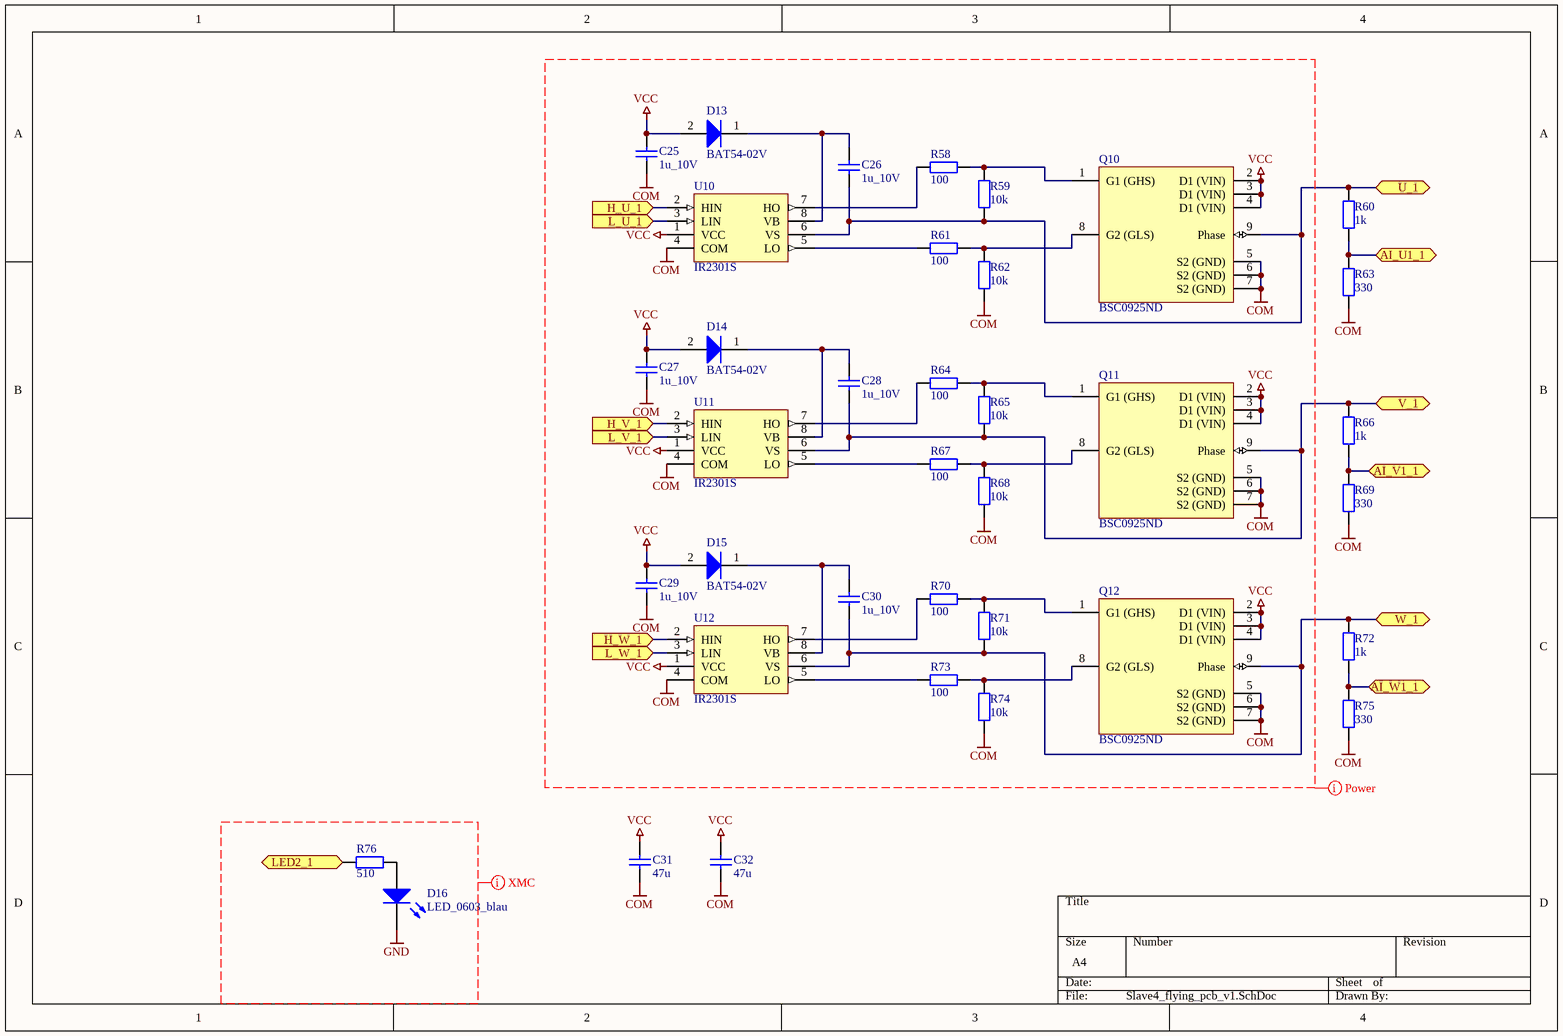
[diagram p4: Slave4_flying_pcb_v1.SchDoc]

### Parts
C25  1u_10V  [1608[0603]]
C26  1u_10V  [1608[0603]]
C27  1u_10V  [1608[0603]]
C28  1u_10V  [1608[0603]]
C29  1u_10V  [1608[0603]]
C30  1u_10V  [1608[0603]]
C31  47u  [_0805]
C32  47u  [_0805]
D13  BAT54-02V  [INF-SC79_V]
D14  BAT54-02V  [INF-SC79_V]
D15  BAT54-02V  [INF-SC79_V]
D16  LED_0603_blau  [LED_0603]
Q10  BSC0925ND  [INF-PG-TISON-8_V]
Q11  BSC0925ND  [INF-PG-TISON-8_V]
Q12  BSC0925ND  [INF-PG-TISON-8_V]
R58  value 100  [1608[0603]]  (hidden comment: Res_0603)
R59  value 10k  [1608[0603]]  (hidden comment: Res_0603)
R60  value 1k  [1608[0603]]  (hidden comment: Res_0603)
R61  value 100  [1608[0603]]  (hidden comment: Res_0603)
R62  value 10k  [1608[0603]]  (hidden comment: Res_0603)
R63  value 330  [1608[0603]]  (hidden comment: Res_0603)
R64  value 100  [1608[0603]]  (hidden comment: Res_0603)
R65  value 10k  [1608[0603]]  (hidden comment: Res_0603)
R66  value 1k  [1608[0603]]  (hidden comment: Res_0603)
R67  value 100  [1608[0603]]  (hidden comment: Res_0603)
R68  value 10k  [1608[0603]]  (hidden comment: Res_0603)
R69  value 330  [1608[0603]]  (hidden comment: Res_0603)
R70  value 100  [1608[0603]]  (hidden comment: Res_0603)
R71  value 10k  [1608[0603]]  (hidden comment: Res_0603)
R72  value 1k  [1608[0603]]  (hidden comment: Res_0603)
R73  value 100  [1608[0603]]  (hidden comment: Res_0603)
R74  value 10k  [1608[0603]]  (hidden comment: Res_0603)
R75  value 330  [1608[0603]]  (hidden comment: Res_0603)
R76  value 510  [1608[0603]]  (hidden comment: Res_0603)
U10  IR2301S  [SO-8_N]
U11  IR2301S  [SO-8_N]
U12  IR2301S  [SO-8_N]

### Ports
AI_U1_1 (bidir), AI_V1_1 (bidir), AI_W1_1 (bidir), H_U_1, H_V_1, H_W_1, L_U_1, L_V_1, L_W_1, LED2_1, U_1 (bidir), V_1 (bidir), W_1 (bidir)

### Nets
COM: C25.2 C27.2 C29.2 C31.1 C32.1 Q10.5(S2_(GND)) Q10.6(S2_(GND)) Q10.7(S2_(GND)) Q11.5(S2_(GND)) Q11.6(S2_(GND)) Q11.7(S2_(GND)) Q12.5(S2_(GND)) Q12.6(S2_(GND)) Q12.7(S2_(GND)) R62.2 R63.2 R68.2 R69.2 R74.2 R75.2 U10.4(COM) U11.4(COM) U12.4(COM)
GND: D16.2
VCC: C25.1 C27.1 C29.1 C31.2 C32.2 D13.2(A) D14.2(A) D15.2(A) Q10.2(D1_(VIN)) Q10.3(D1_(VIN)) Q10.4(D1_(VIN)) Q11.2(D1_(VIN)) Q11.3(D1_(VIN)) Q11.4(D1_(VIN)) Q12.2(D1_(VIN)) Q12.3(D1_(VIN)) Q12.4(D1_(VIN)) U10.1(VCC) U11.1(VCC) U12.1(VCC)
NetC26_1: C26.1 D13.1(K) U10.8(VB)
NetC26_2: C26.2 Q10.9(Phase) R59.2 R60.1 U10.6(VS) ; port U_1
NetC28_1: C28.1 D14.1(K) U11.8(VB)
NetC28_2: C28.2 Q11.9(Phase) R65.2 R66.1 U11.6(VS) ; port V_1
NetC30_1: C30.1 D15.1(K) U12.8(VB)
NetC30_2: C30.2 Q12.9(Phase) R71.2 R72.1 U12.6(VS) ; port W_1
NetD16_1: D16.1 R76.2
NetQ10_1: Q10.1(G1_(GHS)) R58.1 R59.1
NetQ10_8: Q10.8(G2_(GLS)) R61.1 R62.1
NetQ11_1: Q11.1(G1_(GHS)) R64.1 R65.1
NetQ11_8: Q11.8(G2_(GLS)) R67.1 R68.1
NetQ12_1: Q12.1(G1_(GHS)) R70.1 R71.1
NetQ12_8: Q12.8(G2_(GLS)) R73.1 R74.1
NetR58_2: R58.2 U10.7(HO)
NetR60_2: R60.2 R63.1 ; port AI_U1_1
NetR61_2: R61.2 U10.5(LO)
NetR64_2: R64.2 U11.7(HO)
NetR66_2: R66.2 R69.1 ; port AI_V1_1
NetR67_2: R67.2 U11.5(LO)
NetR70_2: R70.2 U12.7(HO)
NetR72_2: R72.2 R75.1 ; port AI_W1_1
NetR73_2: R73.2 U12.5(LO)
NetR76_1: R76.1 ; port LED2_1
NetU10_2: U10.2(HIN) ; port H_U_1
NetU10_3: U10.3(LIN) ; port L_U_1
NetU11_2: U11.2(HIN) ; port H_V_1
NetU11_3: U11.3(LIN) ; port L_V_1
NetU12_2: U12.2(HIN) ; port H_W_1
NetU12_3: U12.3(LIN) ; port L_W_1

### Layout directives
net class Power: COM, VCC
net class XMC: GND

### Library data of the parts
C25-C30 = Cap_133: as C1 on sheet Slave1_flying_pcb_v1; UID: Cap_133; Name: 1u_10V; Name_Hyperlink: http://at.rs-online.com/web/p/keramik-multilayer-kondensatoren/7882884; ComponentLink1URL: #NAME?; mounting: SMD
C31 C32 = Cap_133: as C7 on sheet Slave1_flying_pcb_v1; UID: Cap_133; ComponentLink1URL: #NAME?; mounting: SMD; Name_Hyperlink: http://at.rs-online.com/web/p/keramik-multilayer-kondensatoren/7236350/
D13-D15 = BAT54-02V: as D1 on sheet Slave1_flying_pcb_v1; PackageReference: SC79; PackageDescription: 2-Pin Semiconductor Package, 0.8 x 1.2 mm Body; Supplier 1: Mouser; Supplier Part Number 1: N/A; Halogen-free: FALSE; Mounting Technology: Surface Mount; PartNumber: BAT54-02V; ComponentLink1Description: Manufacturer URL; ComponentLink1URL: http://www.infineon.com/; ComponentLink2Description: Datasheet; ComponentLink2URL: http://www.infineon.com/dgdl/bat54series.pdf?folderId=db3a30431400ef68011425f1ca2505e3&fileId=db3a304314dca3890115190b74210ea6; ComponentLink3Description: Package Specification; ComponentLink3URL: http://www.infineon.com/dgdl/SC79-Package_Overview.pdf?folderId=db3a30431936bc4b011951fbddb03b15&fileId=db3a30431936bc4b01195226fe583b41
D16 = DIODE_60: as D4 on sheet Slave1_flying_pcb_v1; UID: DIODE_60; Name: LED_0603_blau; Name_Hyperlink: http://at.rs-online.com/web/p/products/6973610P/; ComponentLink1URL: #WERT!; mounting: SMD
Q10-Q12 = BSC0925ND: as Q1 on sheet Slave1_flying_pcb_v1; DatasheetVersion: Rev. 1.0; PackageVersion: Rev. 01, 09/2011; PackageReference: PG-TISON-8; PackageDescription: 8-Pin Plastic (Green) Small Outline Non-Leaded Package, 5 x 6 mm Body, 1.27 mm Pitch; Halogen-free: TRUE; Packing: Reel; RthJC (max): 4.2 K/W; Mounting Technology: Surface Mount; PartNumber: BSC0925ND; ComponentLink1Description: Manufacturer URL; ComponentLink1URL: http://www.infineon.com/; ComponentLink2Description: Datasheet; ComponentLink2URL: http://www.infineon.com/dgdl/BSC0925ND_rev1+0.pdf?folderId=db3a304313b8b5a60113cee8763b02d7&fileId=db3a304336ca04c90136cec562a24914; ComponentLink3Description: Package Specification; ComponentLink3URL: http://www.infineon.com/dgdl/BSC0910NDI_Rev. 0.5.pdf?folderId=db3a304313b8b5a60113cee8763b02d7&fileId=db3a304336ca04c90136cedc08b64926
R58-R76 = Res_6: UID: Res_6; Name: Res_0603; ComponentLink1URL: #NAME?; mounting: SMD
U10-U12 = IR2101S: High and Low Side Driver; Published: 8-Jun-2000; LatestRevisionDate: 13-Apr-2006; LatestRevisionNote: IPC-7351 Footprint Added.; DatasheetVersion: PD60043J; PackageVersion: Feb-2001; PackageReference: SO-8; Publisher: Altium Limited; PackageDescription: 8-Pin Plastic Small Outline Integrated Circuit 1.27 mm Pitch; Code_JEDEC: MS-012-AA; Code_IPC: SOIC127P600-8; ComponentLink1Description: Manufacturer Link; ComponentLink1URL: http://www.irf.com/

## Sheet Sensors_flying_pcb.SchDoc
size A4
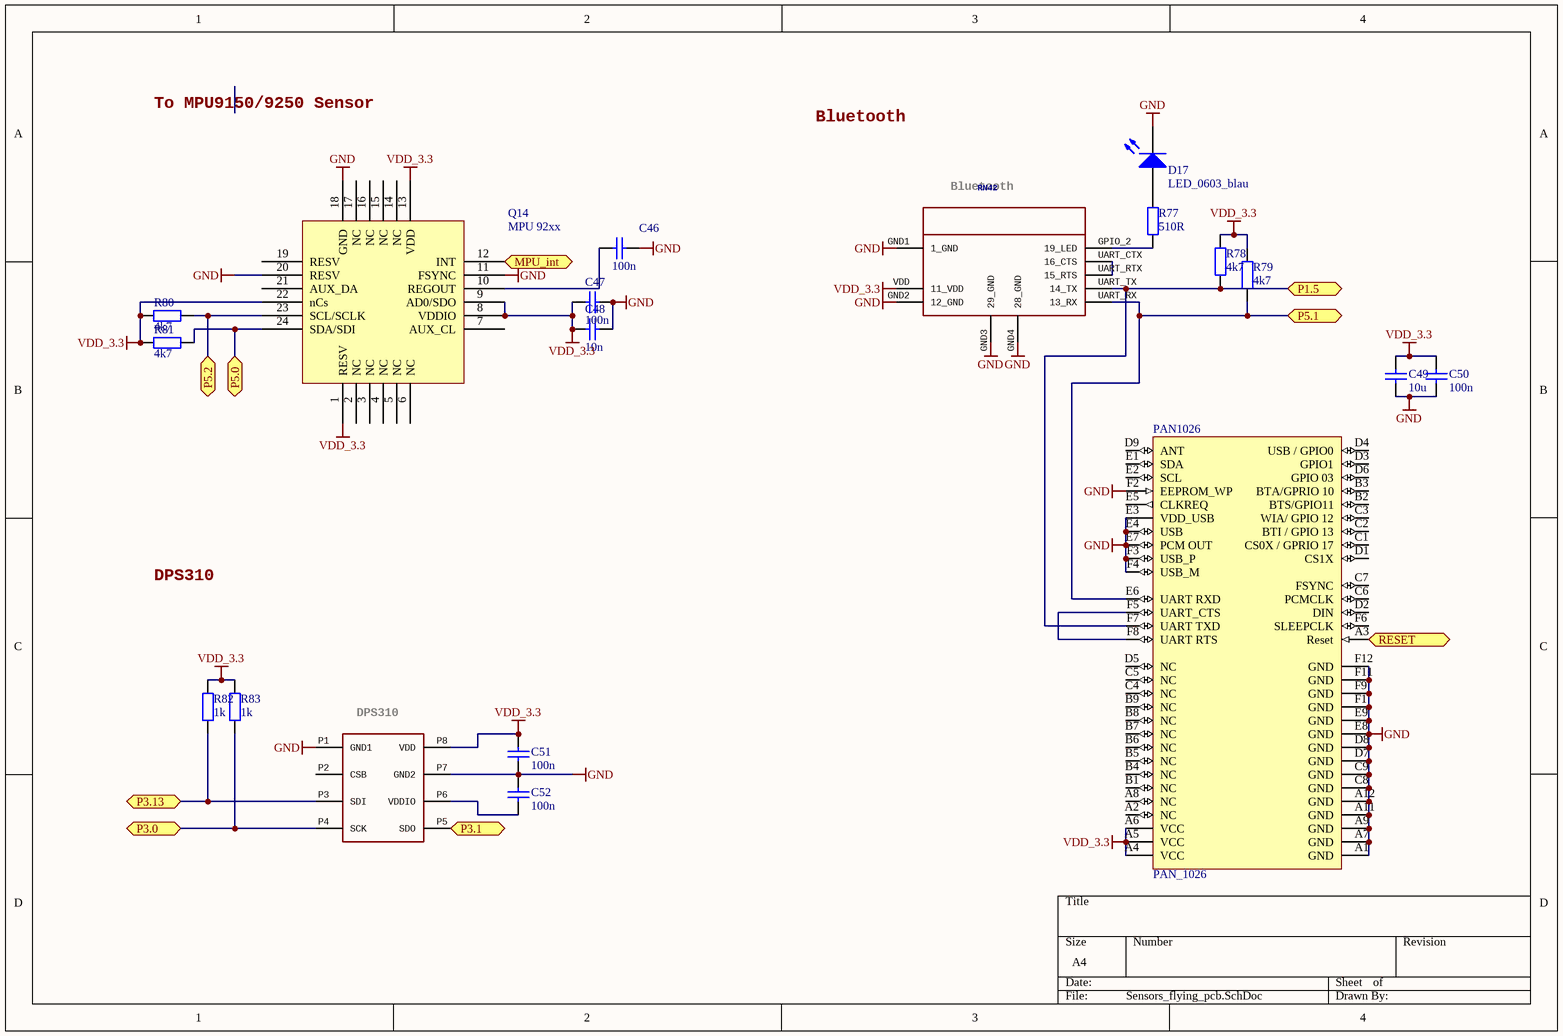
[diagram p5: Sensors_flying_pcb.SchDoc]

### Parts
C46  100n  [_0603]
C47  100n  [_0603]
C48  10n  [_0603]
C49  10u  [_0603]
C50  100n  [_0603]
C51  100n  [_0603]
C52  100n  [_0603]
D17  LED_0603_blau  [LED_0603]
DPS310  Infineon  [LGA8R125P0X4_500X300X120]  (value not drawn)
PAN1026  PAN_1026  [LGA49C120P12X6_1560X870X180]
Q14  MPU 92xx  [PQFN40P300X300X100_HS-25M]
R77  510R  [_0603]
R78  4k7  [_0603]
R79  4k7  [_0603]
R80  4k7  [_0603]
R81  4k7  [_0603]
R82  1k  [_0603]
R83  1k  [_0603]
RN42  >NAME: RN42  [RN42+SHIELD]  (hidden comment: n.m.)

### Ports
MPU_int, P1.5, P3.0, P3.1, P3.13, P5.0, P5.1, P5.2, RESET

### Nets
GND: C46.1 C47.1 C48.1 C49.1 C50.1 C51.1 C52.1 D17.2 DPS310.P1(GND1) DPS310.P7(GND2) PAN1026.A1(GND) PAN1026.A7(GND) PAN1026.A9(GND) PAN1026.A11(GND) PAN1026.A12(GND) PAN1026.C8(GND) PAN1026.C9(GND) PAN1026.D7(GND) PAN1026.D8(GND) PAN1026.E3(VDD_USB) PAN1026.E4(USB) PAN1026.E7(PCM_OUT) PAN1026.E8(GND) PAN1026.E9(GND) PAN1026.F1(GND) PAN1026.F2(EEPROM_WP) PAN1026.F3(USB_P) PAN1026.F4(USB_M) PAN1026.F9(GND) PAN1026.F11(GND) PAN1026.F12(GND) Q14.11(FSYNC) Q14.18(GND) Q14.20(RESV) RN42.GND1(1_GND) RN42.GND2(12_GND) RN42.GND3(29_GND) RN42.GND4(28_GND)
VDD_3.3: C47.2 C48.2 C49.2 C50.2 C51.2 DPS310.P8(VDD) PAN1026.A4(VCC) PAN1026.A5(VCC) PAN1026.A6(VCC) Q14.1(RESV) Q14.8(VDDIO) Q14.9(AD0/SDO) Q14.13(VDD) Q14.22(nCs) R78.1 R79.1 R80.2 R81.2 R82.2 R83.2 RN42.VDD(11_VDD)
NetC46_2: C46.2 Q14.10(REGOUT)
NetC52_2: C52.2 DPS310.P6(VDDIO)
NetD17_1: D17.1 R77.1
NetDPS310_P3: DPS310.P3(SDI) R82.1 ; port P3.13
NetDPS310_P4: DPS310.P4(SCK) R83.1 ; port P3.0
NetDPS310_P5: DPS310.P5(SDO) ; port P3.1
NetPAN1026_A3: PAN1026.A3(Reset) ; port RESET
NetPAN1026_E6: PAN1026.E6(UART_RXD) R79.2 RN42.UART_RX(13_RX) ; port P5.1
NetPAN1026_F5: PAN1026.F5(UART_CTS) PAN1026.F8(UART_RTS)
NetPAN1026_F7: PAN1026.F7(UART_TXD) R78.2 RN42.UART_TX(14_TX) ; port P1.5
NetQ14_12: Q14.12(INT) ; port MPU_int
NetQ14_23: Q14.23(SCL/SCLK) R80.1 ; port P5.2
NetQ14_24: Q14.24(SDA/SDI) R81.1 ; port P5.0
NetR77_2: R77.2 RN42.GPIO_2(19_LED)
NetRN42_UART_CTX: RN42.UART_CTX(16_CTS) RN42.UART_RTX(15_RTS)

Not connected (* = marked no-connect by the designer): DPS310 P2(CSB); PAN1026 A2(NC) A8(NC) B1(NC) B2(BTS/GPIO11) B3(BTA/GPRIO_10) B4(NC) B5(NC) B6(NC) B7(NC) B8(NC) B9(NC) C1(CS0X_/_GPRIO_17) C2(BTI_/_GPIO_13) C3(WIA/_GPIO_12) C4(NC) C5(NC) C6(PCMCLK) C7(FSYNC) D1(CS1X) D2(DIN) D3(GPIO1) D4(USB_/_GPIO0) D5(NC) D6(GPIO_03) D9(ANT) E1(SDA) E2(SCL) E5(CLKREQ) F6(SLEEPCLK); Q14 2(NC) 3(NC) 4(NC) 5(NC) 6(NC) 7(AUX_CL) 14(NC) 15(NC) 16(NC) 17(NC) 19(RESV) 21(AUX_DA)

### Notes on the sheet
- To MPU9150/9250 Sensor
- Bluetooth
- DPS310
- (near DPS310) DPS310

### Library data of the parts
C46-C52 = Cap_129: Name: Cap_0603; QR: 0; UID: Cap_129; ComponentLink1URL: #NAME?; mounting: SMD
D17 = DIODE_60: as D4 on sheet Slave1_flying_pcb_v1; UID: DIODE_60; Name: LED_0603_blau; Name_Hyperlink: http://at.rs-online.com/web/p/products/6973610P/; ComponentLink1URL: #WERT!; mounting: SMD
DPS310 = DPS310DRUCKSENSOR
R77-R83 = Res_5: Name: Res_0603; UID: Res_5; ComponentLink1URL: #NAME?; mounting: SMD
RN42 = BLUETOOTHRN42+SHIELD

## Sheet conroller_flying_pcb.SchDoc
size A3
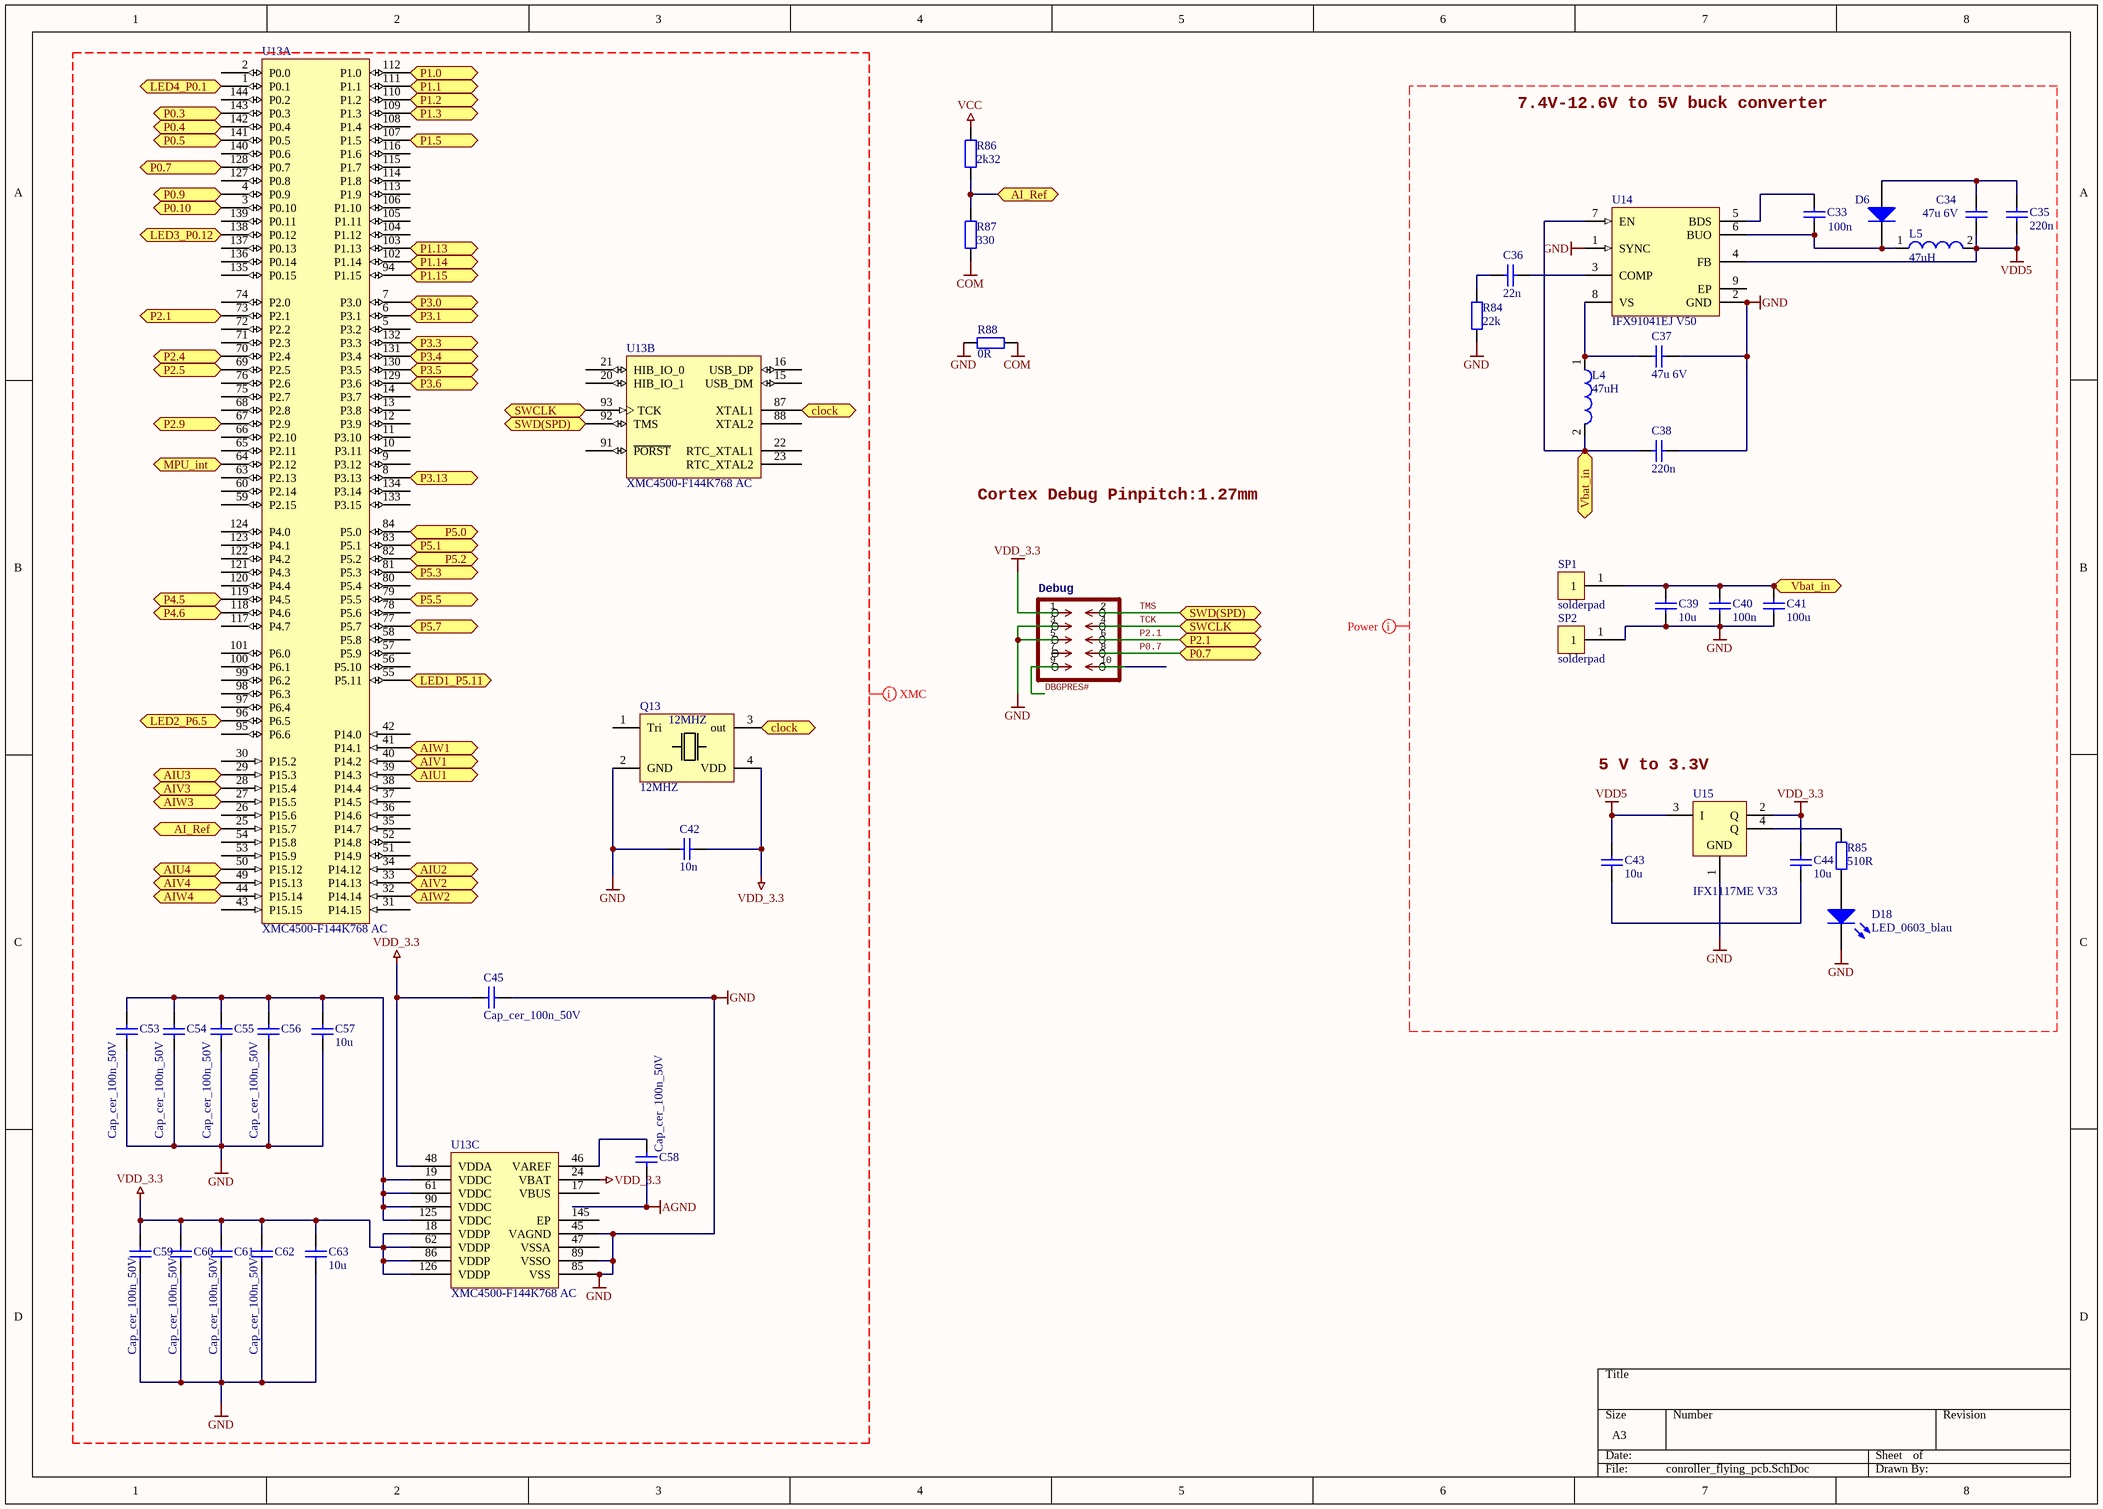
[diagram p6: conroller_flying_pcb.SchDoc]

### Parts
(Parts that share a designator on the sheet are numbered #1, #2 ... from top to bottom, then left to right.)
C33  100n  [_0603]
C34  47u 6V  [_0805]
C35  220n  [_0603]
C36  22n  [_0603]
C37  47u 6V  [_0805]
C38  220n  [_0603]
C39  10u  [_0603]
C40  100n  [_0603]
C41  100u  [_0603]
C42  10n  [_0603]
C43  10u  [_0603]
C44  10u  [_0603]
C45  Cap_cer_100n_50V  [1608[0603]]
C53  Cap_cer_100n_50V  [1608[0603]]
C54  Cap_cer_100n_50V  [1608[0603]]
C55  Cap_cer_100n_50V  [1608[0603]]
C56  Cap_cer_100n_50V  [1608[0603]]
C57  10u  [_0603]
C58  Cap_cer_100n_50V  [1608[0603]]
C59  Cap_cer_100n_50V  [1608[0603]]
C60  Cap_cer_100n_50V  [1608[0603]]
C61  Cap_cer_100n_50V  [1608[0603]]
C62  Cap_cer_100n_50V  [1608[0603]]
C63  10u  [_0603]
D6#2  BAS21-03W  [INF-SOD323_V_1PRIMARY]  (value not drawn)
D18  LED_0603_blau  [LED_0603]
Debug  FTSH-105-01-F-D-K  [FTSH-105-01-F-D-K]  (value not drawn)
L4  47uH  [WE-TPC-3816-S]
L5  47uH  [WE-TPC-3816-S]
Q13  12MHZ  [cmos crystal]
R84  22k  [_0603]
R85  510R  [_0603]
R86  value 2k32  [1608[0603]]  (hidden comment: Res_0603)
R87  value 330  [1608[0603]]  (hidden comment: Res_0603)
R88  value 0R  [1608[0603]]  (hidden comment: Res_0603)
SP1  solderpad  [solderpad1]
SP2  solderpad  [solderpad1]
U13  XMC4500-F144K768 AC  [INF-PG-LQFP-144-18-6500X6500TP_N]  (parts A,B,C of 3)
U14  IFX91041EJ V50  [INF-PG-DSO-8-27_N]
U15  IFX1117ME V33  [INF-PG-SOT223_SC-73_N]

### Ports
AI_Ref (bidir), AIU1, AIU2, AIU3, AIU4, AIV1, AIV2, AIV3, AIV4, AIW1, AIW2, AIW3, AIW4, clock, LED1_P5.11, LED2_P6.5, LED3_P0.12, LED4_P0.1, MPU_int, P0.3, P0.4, P0.5, P0.7, P0.9, P0.10, P1.0, P1.1, P1.2, P1.3, P1.5, P1.13, P1.14, P1.15, P2.1, P2.4, P2.5, P2.9, P3.0, P3.1, P3.3, P3.4, P3.5, P3.6, P3.13, P4.5, P4.6, P5.0, P5.1, P5.2, P5.3, P5.5, P5.7, SWCLK, SWD(SPD), Vbat_in

### Nets
AGND: C58.2
COM: R87.2 R88.2
GND: C37.1 C38.1 C39.2 C40.2 C41.2 C42.1 C45.1 C53.1 C54.1 C55.1 C56.1 C57.1 C59.1 C60.1 C61.1 C62.1 C63.1 D18.2 Debug.3 Debug.5 Q13.2(GND) R84.1 R88.1 SP2.1 U13.45(VAGND) U13.85(VSS) U13.89(VSSO) U14.1(SYNC) U14.2(GND) U15.1(GND)
VCC: R86.1
VDD5: C34.1 C35.2 C43.2 L5.2 U14.4(FB) U15.3(I)
VDD_3.3: C42.2 C44.2 C45.2 C59.2 C60.2 C61.2 C62.2 C63.2 Debug.1 Q13.4(VDD) U13.18(VDDP) U13.24(VBAT) U13.48(VDDA) U13.62(VDDP) U13.86(VDDP) U13.126(VDDP) U15.2(Q)
DBGPRES#: Debug.9
P0.7: Debug.8 U13.128(P0.7) ; port P0.7
P2.1: Debug.6 U13.73(P2.1) ; port P2.1
TCK: Debug.4 U13.93(TCK) ; port SWCLK
TMS: Debug.2 U13.92(TMS) ; port SWD(SPD)
NetC33_1: C33.1 U14.5(BDS)
NetC33_2: C33.2 D6#2.2 L5.1 U14.6(BUO)
NetC34_2: C34.2 C35.1 D6#2.1
NetC36_1: C36.1 U14.3(COMP)
NetC36_2: C36.2 R84.2
NetC37_2: C37.2 L4.1 U14.8(VS)
NetC38_2: C38.2 C39.1 C40.1 C41.1 L4.2 SP1.1 U14.7(EN) ; port Vbat_in
NetC43_1: C43.1 C44.1
NetC53_2: C53.2 C54.2 C55.2 C56.2 C57.2 U13.19(VDDC) U13.61(VDDC) U13.90(VDDC) U13.125(VDDC)
NetC58_1: C58.1 U13.46(VAREF)
NetD18_1: D18.1 R85.1
NetDPS310_P3: U13.6(P3.1) ; port P3.1
NetDPS310_P4: U13.8(P3.13) ; port P3.13
NetDPS310_P5: U13.7(P3.0) ; port P3.0
NetPAN1026_E6: U13.83(P5.1) ; port P5.1
NetPAN1026_F7: U13.107(P1.5) ; port P1.5
NetQ13_3: Q13.3(out) U13.87(XTAL1) ; port clock
NetQ14_12: U13.64(P2.12) ; port MPU_int
NetQ14_23: U13.82(P5.2) ; port P5.2
NetQ14_24: U13.84(P5.0) ; port P5.0
NetR3_2: U13.39(P14.3) ; port AIU1
NetR9_2: U13.40(P14.2) ; port AIV1
NetR15_2: U13.41(P14.1) ; port AIW1
NetR19_1: U13.55(P5.11) ; port LED1_P5.11
NetR22_2: U13.34(P14.12) ; port AIU2
NetR28_2: U13.33(P14.13) ; port AIV2
NetR34_2: U13.32(P14.14) ; port AIW2
NetR38_1: U13.96(P6.5) ; port LED2_P6.5
NetR41_2: U13.29(P15.3) ; port AIU3
NetR47_2: U13.28(P15.4) ; port AIV3
NetR53_2: U13.27(P15.5) ; port AIW3
NetR57_1: U13.138(P0.12) ; port LED3_P0.12
NetR60_2: U13.50(P15.12) ; port AIU4
NetR66_2: U13.49(P15.13) ; port AIV4
NetR72_2: U13.44(P15.14) ; port AIW4
NetR76_1: U13.1(P0.1) ; port LED4_P0.1
NetR85_2: R85.2 U15.4(Q)
NetR86_2: R86.2 R87.1 U13.25(P15.7) ; port AI_Ref
NetU1_2: U13.141(P0.5) ; port P0.5
NetU1_3: U13.3(P0.10) ; port P0.10
NetU2_2: U13.142(P0.4) ; port P0.4
NetU2_3: U13.4(P0.9) ; port P0.9
NetU3_2: U13.143(P0.3) ; port P0.3
NetU3_3: U13.67(P2.9) ; port P2.9
NetU4_2: U13.94(P1.15) ; port P1.15
NetU4_3: U13.77(P5.7) ; port P5.7
NetU5_2: U13.102(P1.14) ; port P1.14
NetU5_3: U13.79(P5.5) ; port P5.5
NetU6_2: U13.103(P1.13) ; port P1.13
NetU6_3: U13.81(P5.3) ; port P5.3
NetU7_2: U13.109(P1.3) ; port P1.3
NetU7_3: U13.110(P1.2) ; port P1.2
NetU8_2: U13.111(P1.1) ; port P1.1
NetU8_3: U13.112(P1.0) ; port P1.0
NetU9_2: U13.69(P2.5) ; port P2.5
NetU9_3: U13.70(P2.4) ; port P2.4
NetU10_2: U13.129(P3.6) ; port P3.6
NetU10_3: U13.130(P3.5) ; port P3.5
NetU11_2: U13.131(P3.4) ; port P3.4
NetU11_3: U13.132(P3.3) ; port P3.3
NetU12_2: U13.118(P4.6) ; port P4.6
NetU12_3: U13.119(P4.5) ; port P4.5

Not connected (* = marked no-connect by the designer): Debug 7 10; Q13 1(Tri); U13 2(P0.0) 5(P3.2) 9(P3.12) 10(P3.11) 11(P3.10) 12(P3.9) 13(P3.8) 14(P3.7) 15(USB_DM) 16(USB_DP) 17(VBUS) 20(HIB_IO_1) 21(HIB_IO_0) 22(RTC_XTAL1) 23(RTC_XTAL2) 26(P15.6) 30(P15.2) 31(P14.15) 35(P14.7) 36(P14.6) 37(P14.5) 38(P14.4) 42(P14.0) 43(P15.15) 47(VSSA) 51(P14.9) 52(P14.8) 53(P15.9) 54(P15.8) 56(P5.10) 57(P5.9) 58(P5.8) 59(P2.15) 60(P2.14) 63(P2.13) 65(P2.11) 66(P2.10) 68(P2.8) 71(P2.3) 72(P2.2) 74(P2.0) 75(P2.7) 76(P2.6) 78(P5.6) 80(P5.4) 88(XTAL2) 91(~{PORST}) 95(P6.6) 97(P6.4) 98(P6.3) 99(P6.2) 100(P6.1) 101(P6.0) 104(P1.12) 105(P1.11) 106(P1.10) 108(P1.4) 113(P1.9) 114(P1.8) 115(P1.7) 116(P1.6) 117(P4.7) 120(P4.4) 121(P4.3) 122(P4.2) 123(P4.1) 124(P4.0) 127(P0.8) 133(P3.15) 134(P3.14) 135(P0.15) 136(P0.14) 137(P0.13) 139(P0.11) 140(P0.6) 144(P0.2) 145(EP); U14 9(EP)

### Layout directives
net class Undefined: AGND, GND, VDD5, VDD_3.3

### Notes on the sheet
- 7.4V-12.6V to 5V buck converter
- Cortex Debug
  Pinpitch:1.27mm
- (near U15) 5 V to 3.3V

### Library data of the parts
C33 C35 C36 C38-C44 C57 C63 = Cap_129: Name: Cap_0603; QR: 0; UID: Cap_129; ComponentLink1URL: #NAME?; mounting: SMD
C34 C37 = Cap_133: Name: Cap_cer_1u_50V; RS_number: 723-6350; QR: 0; Capacity: 1u; Voltage: 50V; UID: Cap_133; Name_Hyperlink: http://at.rs-online.com/web/p/keramik-multilayer-kondensatoren/7236350/; ComponentLink1URL: #NAME?; mounting: SMD
C45 C53-C56 C58-C62 = Cap_124: QR: 0; Capacity: 100n; Voltage: 50V; RS Bestellnummer: 788-2985; UID: Cap_124; Name: Cap_cer_100n_50V; ComponentLink1URL: #NAME?; mounting: SMD0603
D6#2 = INF-SOD323_V_1
D18 = DIODE_60: as D4 on sheet Slave1_flying_pcb_v1; UID: DIODE_60; Name: LED_0603_blau; Name_Hyperlink: http://at.rs-online.com/web/p/products/6973610P/; ComponentLink1URL: #WERT!; mounting: SMD
L4 L5 = 744031001: SMD Shielded Tiny Power Inductor WE-TPC, L = 1.50 µH; Inductance: 1.50 µH; DatasheetVersion: ver 6, Jan-2009; PackageReference: WE-TPC-3816-S; PackageDescription: SMD Inductor, 2-Leads, Body 3.8 x 3.8 mm; PartNumber: 744031001; ComponentLink1Description: Manufacturer URL; ComponentLink1URL: http://www.we-online.com; ComponentLink2Description: Datasheet; ComponentLink2URL: http://www.we-online.de/katalog/media/pdf/744031001.pdf
Q13 = cmos crystal: cmos smd crystal 3,3V; RS Bestellnummer: 703-2344; Spannung: 3.3V; Frequenz: 12MHZ; Typ: SMD
R84 R85 = Res_5: Name: Res_0603; UID: Res_5; ComponentLink1URL: #NAME?; mounting: SMD
R86-R88 = Res_6: UID: Res_6; Name: Res_0603; ComponentLink1URL: #NAME?; mounting: SMD
U13 = XMC4500-F144K768 AC: 120 MHz XMC4500 MCU with 768 KByte Program Memory, 160 KByte SRAM, 3.3 V, -40 to 125 degC, PG-LQFP-144, Tray, Green; Manufacturer: Infineon; A / D input lines (incl. FADC): 26; Digital I/O Lines: 91; Green: TRUE; I/O Operation Voltages: 3.3 V; Instruction set architecture: ARM(R) Cortex(TM)-M4 (32-bit); Max Clock Frequency: 120 MHz; Type of Memory: Flash; Type of Serial I/O Interfaces: UART,SPI,I2C,I2S,LIN,CAN,Ethernet 10/100,USB; DatasheetVersion: Rev. 1.3; PackageReference: PG-LQFP-144-18; PackageDescription: 144-Pin Plastic (Green) Low Profile Quad Flat Package, 20 x 20 mm Body, 0.5 mm Pitch; Group: XMC4500; Halogen-free: TRUE; Packing: Tray; Program Memory: 768 KByte; SRAM (incl. Cache): 160 KByte; Mounting Technology: Surface Mount; PartNumber: XMC4500-F144K768 AC; ComponentLink1Description: Manufacturer URL; ComponentLink1URL: http://www.infineon.com/; ComponentLink2Description: Datasheet; ComponentLink2URL: http://www.infineon.com/dgdl/xmc4500_ds_v1.3_2014_03.pdf?folderId=db3a30433580b3710135a47f3eb76c98&fileId=db3a304335b504400135bdca7ed86742; ComponentLink3Description: Package Specification; ComponentLink3URL: http://www.infineon.com/cms/packages/SMD_-_Surface_Mounted_Devices/P-PG-LQFP/P-PG-LQFP-144-04x_13x_14x_15x_16x_18x_23.html?__locale=en
U14 = IFX91041EJ V50: 1.8 A DC/DC Step-Down Voltage Regulator, -40 to 150 degC, PG-DSO-8-27, Reel, Green; Manufacturer: Infineon; Green: TRUE; IQ (max): 1,800 mA; Iq (typ): 7,000 uA; Max Number Reflow: 3; Max Peak Reflow Temp: 260 degreesC; Output: Buck Converter; Reset: FALSE; Tolerance: 2(4)%; VQ (max): 5 V; DatasheetVersion: Rev. 1.1; PackageVersion: V01, 06/2012; PackageReference: PG-DSO-8-27; PackageDescription: 8-Pin Plastic (Green) Dual Small Outline Package, 4.9 x 3.9 mm Body, 1.27 mm Pitch; Supplier 1: Mouser; Supplier Part Number 1: 726-IFX91041EJV50; Supplier 2: Newark; Supplier Part Number 2: 78X5181; Supplier 3: Farnell; Supplier Part Number 3: 2432504; Supplier 4: Digi-Key; Supplier Part Number 4: IFX91041EJ V50INTR-ND; Supplier 5: Digi-Key; Supplier Part Number 5: IFX91041EJ V50INCT-ND; Supplier 6: Digi-Key; Supplier Part Number 6: IFX91041EJ V50INDKR-ND; Halogen-free: TRUE; Inhibit: TRUE; MSL: 3; Packing: Reel; Protect: TRUE; Mounting Technology: Surface Mount; Code_JEDEC: MS-012; PartNumber: IFX91041EJ V50; ComponentLink1Description: Manufacturer URL; ComponentLink1URL: http://www.infineon.com/; ComponentLink2Description: Datasheet; ComponentLink2URL: http://www.infineon.com/dgdl/IFX91041_DS_11.pdf?folderId=db3a304314dca3890115039cf70d0bf0&fileId=db3a304320d39d59012153afb91a0548; ComponentLink3Description: Package Specification; ComponentLink3URL: http://www.infineon.com/dgdl/ILD4071_DS_V10_November2011.pdf?folderId=db3a30431f848401011fcbf2ab4c04c4&fileId=db3a30433784a04001380498fdf04c32
U15 = IFX1117ME V33: Voltage Regulator, 4.55 to 15 V Operating, 1000 mA, -40 to 125 degC, PG-SOT223 (SC-73), Reel, Green; Manufacturer: Infineon; Accuracy: 2.0 %; Automotive Qualified: FALSE; Dropout Voltage: 1200 mV; Green: TRUE; Max Number Reflow: 3; Max Peak Reflow Temp: 260 degC; Max. Output Current: 1000 mA; Output Voltage: 3.3 V; Regulator Type: Linear->single output; Typical Quiescent Current: 5000 uA; DatasheetVersion: Rev. 1.0; PackageVersion: Apr-08; PackageReference: PG-SOT223 (SC-73); PackageDescription: 4-Pin Small Outline Transistor Package, 6.5 x 3.5 mm Body, 2.3 mm Pitch; Supplier 1: Mouser; Supplier Part Number 1: 726-IFX1117MEV33; Supplier 2: Digi-Key; Supplier Part Number 2: IFX1117ME V33TR-ND; Supplier 3: Digi-Key; Supplier Part Number 3: IFX1117ME V33CT-ND; Supplier 4: Digi-Key; Supplier Part Number 4: IFX1117ME V33DKR-ND; MSL: 1; Packing: Reel; Reset: FALSE; Status Output: FALSE; Mounting Technology: Surface Mount; PartNumber: IFX1117ME V33; ComponentLink1Description: Manufacturer URL; ComponentLink1URL: http://www.infineon.com/; ComponentLink2Description: Datasheet; ComponentLink2URL: http://www.infineon.com/dgdl/IFX1117ME+V33.pdf?folderId=db3a304318f3fe290118f5a433570040&fileId=db3a30432e779412012e9097d1611987; ComponentLink3Description: Package Specification; ComponentLink3URL: http://www.infineon.com/dgdl/SOT223-Package_Overview.pdf?folderId=db3a30431936bc4b0119530470b03c3d&fileId=db3a30431936bc4b0119531d40b93c5c